# EasyEDA Pro project ProProject_Access Control AC Power Switch_2024-05-28.epro

# Schematic V2.0.1 Power Relay Schematic
Create Date: 2024-05-01; Page Name: P1; Project Name: Access Control V2; Schematic Name: V2.0.1 Power Relay Schematic; Update Date: 2024-05-10; Company: EasyEDA.com; Drawn: EasyEDA; Page Size: A4; Part Number: JLCPCB-002; Reviewed: EasyEDA; Version: V0.1
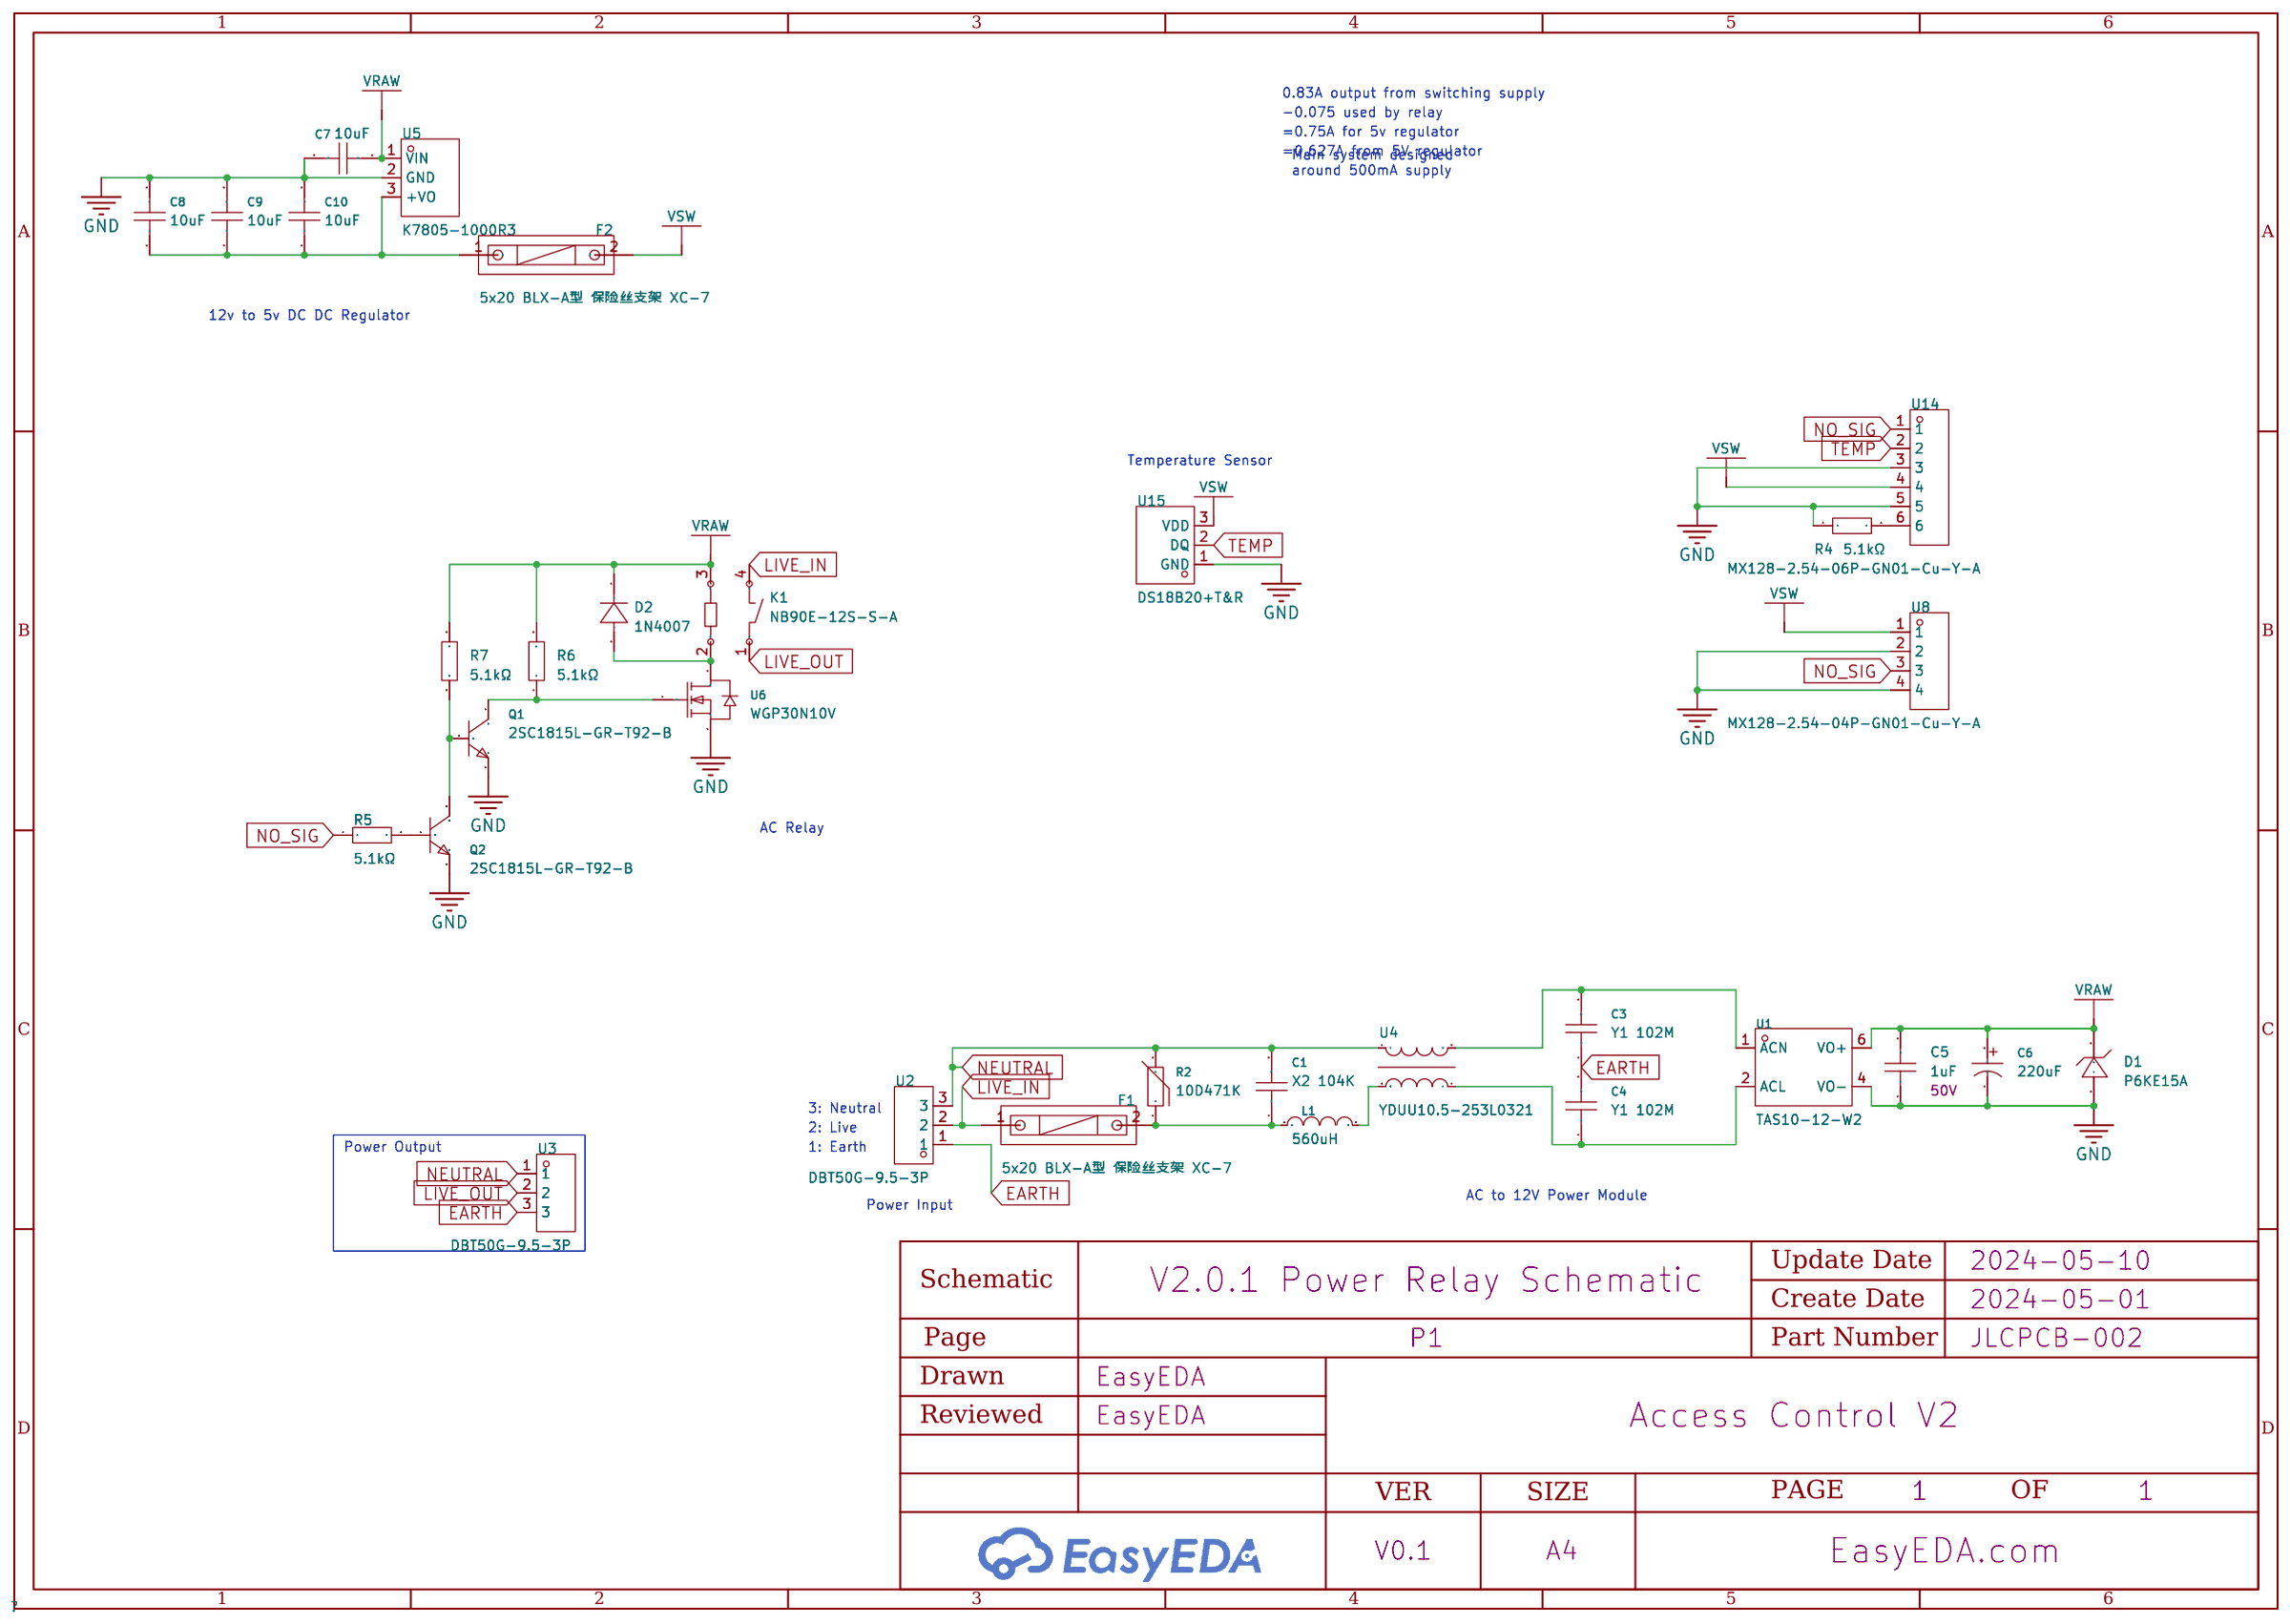
[diagram p0: schematic sheet]

## Parts
C1  100nF  [CAP-TH_L10.0-W5.0-P7.50-D0.6]
C3  1nF  [CAP-TH_L8.5-W5.0-P10.00-D0.6]
C4  1nF  [CAP-TH_L8.5-W5.0-P10.00-D0.6]
C5  1uF  [CAP-TH_L5.5-W3.5-P5.00-D1.2]
C6  220uF  [CAP-TH_BD6.3-P2.50-D1.0-FD]
C7  10uF  [CAP-TH_L5.5-W3.8-P3.50-D0.6]
C8  10uF  [CAP-TH_L5.5-W3.8-P3.50-D0.6]
C9  10uF  [CAP-TH_L5.5-W3.8-P3.50-D0.6]
C10  10uF  [CAP-TH_L5.5-W3.8-P3.50-D0.6]
D1  P6KE15A  [DO-15_BD3.2-L6.4-P10.40-D0.8-RD]
D2  1N4007  [DO-41_BD2.4-L4.7-P8.70-D0.8-RD]
F1  5x20 BLX-A型 保险丝支架 XC-7  [FUSE-TH_L22.6-W9.0]
F2  5x20 BLX-A型 保险丝支架 XC-7  [FUSE-TH_L22.6-W9.0]
K1  NB90E-12S-S-A  [RELAY-TH_NB90E-XXS-S-A]
L1  560uH  [IND-TH_BD9.0-P5.00-D0.7]
Q1  2SC1815L-GR-T92-B  [TO-92-3_L4.9-W3.7-P2.54-L]
Q2  2SC1815L-GR-T92-B  [TO-92-3_L4.9-W3.7-P2.54-L]
R2  10D471K  [RES-TH_L12.5-W6.7-P7.50-D1.2]
R4  5.1kΩ  [RES-TH_BD2.3-L6.5-P10.50-D0.5]
R5  5.1kΩ  [RES-TH_BD2.3-L6.5-P10.50-D0.5]
R6  5.1kΩ  [RES-TH_BD2.3-L6.5-P10.50-D0.5]
R7  5.1kΩ  [RES-TH_BD2.3-L6.5-P10.50-D0.5]
U1  TAS10-12-W2  [PWRM-TH_TAS10-XX-W2]
U2  DBT50G-9.5-3P  [CONN-TH_3P-P9.50_DBT50G-9.5-3P]
U3  DBT50G-9.5-3P  [CONN-TH_3P-P9.50_DBT50G-9.5-3P]
U4  YDUU10.5-253L0321  [IND-TH_4P-L19.0-W17.0]
U5  K7805-1000R3  [PWRM-TH_YLPTEC_K78XX-1000R3]
U6  WGP30N10V  [TO-220-3_L10.0-W4.6-P2.54-L]
U8  MX128-2.54-04P-GN01-Cu-Y-A  [CONN-TH_4P-P2.54_MX128-2.54-GN01-04P-CU-Y-A]
U14  MX128-2.54-06P-GN01-Cu-Y-A  [CONN-TH_6P-P2.54_MX128-2.54-6P]
U15  DS18B20+T&R  [TO-92-3_L4.9-W3.7-P2.54-L]

## Library data of the parts
C1 = PX104K2C0702: Capacitance: Tolerance:±10% Tolerance:±10% Voltage(AC):310V；380V；350V Subclass: Operating Temperature:-40℃~+110℃ Operating Temperature:-40℃~+110℃; LCSC Part Name: 等级:X2 100nF ±10% 310V 350V 380V; Supplier Part: C2693793; Manufacturer: KYET(科雅); Supplier Footprint: 插件,P=7.5mm; JLCPCB Part Class: Extended Part; Datasheet: https://atta.szlcsc.com/upload/public/pdf/source/20230824/212A883DA7F3524E26A294E17BC5A0F4.pdf; Supplier: LCSC; Tolerance: ±10%; Voltage(AC): 310V；380V；350V; Operating Temperature: -40℃~+110℃
C3 C4 = VY1102M31Y5UC63V0: Capacitance: Tolerance:±20% Tolerance:±20% Voltage(AC):760V Subclass: Operating Temperature:-40℃~+125℃ Operating Temperature:-40℃~+125℃; LCSC Part Name: 等级:X1,Y1 1nF ±20% 760V; Supplier Part: C1620957; Manufacturer: VISHAY(威世); Supplier Footprint: 插件,P=10mm; JLCPCB Part Class: Extended Part; Datasheet: https://atta.szlcsc.com/upload/public/pdf/source/20210503/4C6D9DFEC0766624DBEA7F26F929BB18.pdf; Supplier: LCSC; Tolerance: ±20%; Voltage(AC): 760V; Operating Temperature: -40℃~+125℃
C5 = FK26X7R1H105KRE06: Capacitance: Tolerance:±10% Tolerance:±10% Voltage Rated: Lead Spacing: Temperature Coefficient:; LCSC Part Name: 1uF ±10% 50V; Supplier Part: C2839237; Manufacturer: TDK; Supplier Footprint: 插件,P=5mm; JLCPCB Part Class: Extended Part; Datasheet: https://atta.szlcsc.com/upload/public/pdf/source/20211011/CA0C243CD946D294CDFF83D03DB16AD9.pdf; Supplier: LCSC; Tolerance: ±10%; Voltage Rated: 50V
C6 = KM227M025E11RR0VH2FP0: Capacitance:220uF Tolerance:±20% Tolerance:±20% Rated Voltage: Ripple Current:- Equivalent Series Resistance(ESR):- Lead Spacing: φD: L: Lifetime @ Temp:1000hrs@105℃; LCSC Part Name: 220uF ±20% 25V; Supplier Part: C12450; Manufacturer: CX(承兴); Supplier Footprint: 插件,D6.3xL11mm; JLCPCB Part Class: Extended Part; Datasheet: https://atta.szlcsc.com/upload/public/pdf/source/20211027/06D6BA3719C264B639DC286D935D03EA.pdf; Supplier: LCSC; Tolerance: ±20%; Lifetime @ Temp: 1000hrs@105℃
C7-C10 = CD1E106MC9BER2F100: Capacitance:10uF Tolerance:±20% Tolerance:±20% Voltage Rated: Temperature Coefficient:; LCSC Part Name: 10uF ±20% 25V; Supplier Part: C2761733; Manufacturer: Dersonic(德尔创); Supplier Footprint: 插件,P=5.08mm; JLCPCB Part Class: Extended Part; Datasheet: https://atta.szlcsc.com/upload/public/pdf/source/20210512/C2761733_48A4F8FFA54EF14BEC181E01EC41507A.pdf; Supplier: LCSC; Tolerance: ±20%
D1 = P6KE15A_C1974865: polarity:Unidirectional Reverse Stand-Off Voltage (Vrwm):12.8V Maximum Clamping Voltage:21.2V Peak Pulse Current (Ipp)@10/1000us:28.8A Peak Pulse Power Dissipation (Ppp)@10/1000us:600W Breakdown Voltage:14.3V Type:TVS; LCSC Part Name: TVS 12.8V截止 28.8A峰值脉冲; Supplier Part: C1974865; Manufacturer: Littelfuse(美国力特); Supplier Footprint: DO-15(DO-204AC); JLCPCB Part Class: Extended Part; Datasheet: https://atta.szlcsc.com/upload/public/pdf/source/20210316/C2760121_CE745CC1535F4E7F6CA9D58EF9C8652B.pdf; Supplier: LCSC; polarity: Unidirectional; Reverse Stand-Off Voltage (Vrwm): 12.8V; Maximum Clamping Voltage: 21.2V; Peak Pulse Current (Ipp)@10/1000us: 28.8A; Peak Pulse Power Dissipation (Ppp)@10/1000us: 600W; Breakdown Voltage: 14.3V; Type: TVS
D2 = 1N4007_C2985028: Forward Voltage (Vf@If):1V@1A Reverse Voltage (Vr): Average Rectified Current (Io):; LCSC Part Name: 电压:1kV 电流:1A; Supplier Part: C2985028; Manufacturer: GOODWORK(固得沃克); Supplier Footprint: DO-41; JLCPCB Part Class: Extended Part; Datasheet: https://atta.szlcsc.com/upload/public/pdf/source/20210723/C2848669_ECFE0BC1B34B7BAAA686846FF0F306A7.pdf; Supplier: LCSC; Forward Voltage (Vf@If): 1V@1A
F1 F2 = 5x20 BLX-A型 保险丝支架 XC-7: Fuseholder Type:- Fuse Type:- Fuse Size:-; LCSC Part Name: 保险丝座 5x20 BLX-A型; Supplier Part: C3131; Manufacturer: xcfuse(旭程); JLCPCB Part Class: Extended Part; Datasheet: https://atta.szlcsc.com/upload/public/pdf/source/20160427/1461725215151.pdf; Supplier: LCSC
K1 = NB90E-12S-S-A: Coil Voltage:12V Contact Form:一组常开:1A(SPST-常开) Pin Number:- Contact Rating:- Maximum Switching Voltage:277V@AC；30V@DC Coil Rated Power:900mW Contact Material:AgSnO2 Maximum Switching Current:30A Coil Type:无极性-单线圈 Coil Resistance:160Ω Contact Resistance:10; LCSC Part Name: 12V继电器 单刀单掷-常开; Supplier Part: C396894; Manufacturer: NBC(宝橙); Supplier Footprint: 插件,27.2x32mm; JLCPCB Part Class: Extended Part; Datasheet: https://atta.szlcsc.com/upload/public/pdf/source/20190621/C396896_7BA89285BD2A8229CEB67C9FBB667B77.pdf; Supplier: LCSC; Coil Voltage: 12V; Contact Form: 一组常开:1A(SPST-常开); Maximum Switching Voltage: 277V@AC；30V@DC; Coil Rated Power: 900mW; Contact Material: AgSnO2; Maximum Switching Current: 30A; Coil Type: 无极性-单线圈; Coil Resistance: 160Ω; Contact Resistance: 100mΩ; Operate Time: 15ms; Release Time: 10ms; Operating Temperature: -55℃~+85℃
L1 = PK0810-561KB: Inductance: Tolerance:±10% Tolerance:±10% Rated Current: DC Resistance (DCR): Type:工字电感; LCSC Part Name: 560uH ±10%; Supplier Part: C122800; Manufacturer: SXN(顺翔诺); Supplier Footprint: 插件; JLCPCB Part Class: Extended Part; Datasheet: https://atta.szlcsc.com/upload/public/pdf/source/20210810/BA6D1DA7D4BCBB7C641BC97B42CFC6FF.pdf; Supplier: LCSC; Tolerance: ±10%; Type: 工字电感
Q1 Q2 = 2SC1815L-GR-T92-B: Transistor Type: Collector Current (Ic): Collector-Emitter Breakdown Voltage (Vceo): Power Dissipation (Pd):; LCSC Part Name: 耐压:50V 电流:150mA NPN hfe=200~400; Supplier Part: C73309; Manufacturer: UTC(友顺); Supplier Footprint: TO-92-2.54mm; JLCPCB Part Class: Extended Part; Datasheet: https://atta.szlcsc.com/upload/public/pdf/source/20170209/1486607344255.pdf; Supplier: LCSC
R2 = 10D471K_C8760: Varistor Voltage:423V~517V Varistor Voltage:423V~517V Clamping Voltage: Allowable Voltage (DC): Allowable Voltage (AC): Peak Current: Maximum Energy:42.3J Maximum Energy:42.3J Typical Capatitance:190pF@1kHz; LCSC Part Name: 钳位电压775V 42.3焦耳 插件压敏电阻; Supplier Part: C8760; Manufacturer: RUILON(瑞隆源); Supplier Footprint: 插件; JLCPCB Part Class: Extended Part; Datasheet: https://atta.szlcsc.com/upload/public/pdf/source/20160725/1469440740918.pdf; Supplier: LCSC; Varistor Voltage: 423V~517V; Maximum Energy: 42.3J; Typical Capatitance: 190pF@1kHz
R4-R7 = CF1/4W-5.1KΩ±5% T: Type:Carbon Resister Resistance: Tolerance:±5% Tolerance:±5% Overload Voltage (Max):250V Power(Watts):250mW Temperature Coefficient:±350ppm/℃ Temperature Coefficient:±350ppm/℃ Operating Temperature Range:-55℃~+155℃ Operating Temperature Range:-55℃~+155℃; LCSC Part Name: 5.1kΩ ±5% 250mW 碳膜电阻; Supplier Part: C120072; Manufacturer: CCO(千志电子); Supplier Footprint: 插件,D2.3xL6.5mm; JLCPCB Part Class: Extended Part; Datasheet: https://atta.szlcsc.com/upload/public/pdf/source/20190910/C427328_A0A2D65F3FD547937F4E674C90868175.pdf; Supplier: LCSC; Type: Carbon Resister; Tolerance: ±5%; Overload Voltage (Max): 250V; Power(Watts): 250mW; Temperature Coefficient: ±350ppm/℃; Operating Temperature Range: -55℃~+155℃
U1 = TAS10-12-W2: Conversion Type:AC-DC；AC/DC-DC Input Voltage(DC):100V~370V Input Voltage(DC):100V~370V Output Voltage:12V Output Voltage:12V Output Power:10W Input Voltage(AC):85VAC~265VAC Input Voltage(AC):85VAC~265VAC Output Current (Max):830mA Output Current (Max):830; Supplier Part: C2687656; Manufacturer: TDPOWER(腾达电源); Supplier Footprint: 插件,25x39mm; JLCPCB Part Class: Extended Part; Datasheet: https://atta.szlcsc.com/upload/public/pdf/source/20210914/95F169B7B21081D929A6CFE8A15609A6.pdf; Supplier: LCSC; Conversion Type: AC-DC；AC/DC-DC; Input Voltage(DC): 100V~370V; Output Voltage: 12V; Output Power: 10W; Input Voltage(AC): 85VAC~265VAC; Output Current (Max): 830mA; Function: 降压型; Isolation or not: 隔离; Output Channel: 1; Insulated Voltage: 2.5kV@AC; Conversion Efficiency: 85%; Feature: Overcurrent Protection；短路保护自恢复
U2 U3 = DBT50G-9.5-3P: Barrier Type:带盖板 Pitch:9.5mm Structure:1x3P Mounting Style:直针 Pin Location:边脚 Number of Pins:3P Number of Rows:1 Current Rating (Max):32A Voltage Rating (Max):750V Wire Gauge - AWG:12~22 Wire Gauge - mm2:4 Operating Temperature Range:-40℃~+105℃ Operating; LCSC Part Name: 9.5mm 1x3P 每排P数:3 排数:1 直针 边脚; Supplier Part: C395959; Manufacturer: DORABO(地博电气); Supplier Footprint: 插件,P=9.5mm; JLCPCB Part Class: Extended Part; Datasheet: https://atta.szlcsc.com/upload/public/pdf/source/20221019/84C53DE9D8912EDE417B2211EE296996.pdf; Supplier: LCSC; Barrier Type: 带盖板; Pitch: 9.5mm; Structure: 1x3P; Mounting Style: 直针; Pin Location: 边脚; Number of Pins: 3P; Number of Rows: 1; Current Rating (Max): 32A; Voltage Rating (Max): 750V; Wire Gauge - AWG: 12~22; Wire Gauge - mm2: 4; Operating Temperature Range: -40℃~+105℃; Color: Black; Number of PINs Per Row: 3
U4 = YDUU10.5-253L0321: Number of Lines:2 Withstanding Voltage:1.5kV@AC Inductance @ Frequency:25mH@1KHz; LCSC Part Name: UU10.5 25mH @1KHz; Supplier Part: C5200263; Manufacturer: YJYCOIN(益嘉源); Supplier Footprint: 插件,19x17x22mm; JLCPCB Part Class: Extended Part; Datasheet: https://atta.szlcsc.com/upload/public/pdf/source/20221019/CF3EF2D4E89C9F1A1EF6A77931981DBC.pdf; Supplier: LCSC; Number of Lines: 2; Withstanding Voltage: 1.5kV@AC; Inductance @ Frequency: 25mH@1KHz
U5 = K7805-1000R3: Conversion Type:DC-DC Input Voltage(DC):8V~36V Input Voltage(DC):8V~36V Output Voltage:5V Output Voltage:5V Output Power:5W Output Current (Max):1A Output Current (Max):1A Function:升降压型 Isolation or not:非隔离 Output Channel:1 Insulated Voltage:- Conversion; LCSC Part Name: DC-DC 输入电压8V~36V 输出电压5V输出功率5W1000mA; Supplier Part: C2992391; Manufacturer: YLPTEC(易川); Supplier Footprint: 插件; JLCPCB Part Class: Extended Part; Datasheet: https://atta.szlcsc.com/upload/public/pdf/source/20220510/13042FEFCE8A01FC3BA968F60B4D6D28.pdf; Supplier: LCSC; Conversion Type: DC-DC; Input Voltage(DC): 8V~36V; Output Voltage: 5V; Output Power: 5W; Output Current (Max): 1A; Function: 升降压型; Isolation or not: 非隔离; Output Channel: 1; Conversion Efficiency: 93%; Feature: Short-Circuit Protection；Low-Power Consumption; Maximum Capacitive Load: 680uF
U6 = WGP30N10V: Type:1个NChannel Drain Source Voltage (Vdss): Continuous Drain Current (Id): Power Dissipation (Pd): Drain Source On Resistance (RDS(on)@Vgs,Id):36mΩ@10V,; LCSC Part Name: 1个N沟道 耐压:100V 电流:30A; Supplier Part: C17702381; Manufacturer: Wild Goose(威谷); Supplier Footprint: TO-220; Datasheet: https://atta.szlcsc.com/upload/public/pdf/source/20230915/178B7459ABA4E98915C1CC177AA9479D.pdf; Supplier: LCSC; Type: 1个NChannel; Drain Source On Resistance (RDS(on)@Vgs,Id): 36mΩ@10V,
U8 = MX128-2.54-04P-GN01-Cu-Y-A: Structure:1x4P Pitch:2.54mm Color:Green Mounting Style:Straight Current Rating (Max):6A Voltage Rating (Max):150V Number of Pins:4P Number of Rows:1 Wire Gauge - AWG:18~24 Wire Gauge - AWG:18~24 Wire Gauge - mm2:1 Wire Gauge - mm2:1 Number of PINs Per Row; LCSC Part Name: 2.54mm 1x4P 排数:1 每排P数:4 直插; Supplier Part: C5188444; Manufacturer: MAX(迈旭); Supplier Footprint: 插件,P=2.54mm; JLCPCB Part Class: Extended Part; Datasheet: https://atta.szlcsc.com/upload/public/pdf/source/20230914/7C75AD31AD41EB9EF855A76DB002C0D2.pdf; Supplier: LCSC; Structure: 1x4P; Pitch: 2.54mm; Color: Green; Mounting Style: Straight; Current Rating (Max): 6A; Voltage Rating (Max): 150V; Number of Pins: 4P; Number of Rows: 1; Wire Gauge - AWG: 18~24; Wire Gauge - mm2: 1; Number of PINs Per Row: 4; Contact Material: Copper Alloy; Contact Plating: Tin; Operating Temperature Range: -40℃~+105℃
U14 = MX128-2.54-06P-GN01-Cu-Y-A: Structure:1x6P Pitch:2.54mm Color:Green Mounting Style:Straight Current Rating (Max):6A Voltage Rating (Max):150V Number of Pins:6P Number of Rows:1 Wire Gauge - AWG:18~24 Wire Gauge - AWG:18~24 Wire Gauge - mm2:1 Wire Gauge - mm2:1 Number of PINs Per Row; LCSC Part Name: 2.54mm 1x6P 排数:1 每排P数:6 直插; Supplier Part: C5188446; Manufacturer: MAX(迈旭); Supplier Footprint: 插件,P=2.54mm; JLCPCB Part Class: Extended Part; Datasheet: https://atta.szlcsc.com/upload/public/pdf/source/20230914/7C75AD31AD41EB9EF855A76DB002C0D2.pdf; Supplier: LCSC; Structure: 1x6P; Pitch: 2.54mm; Color: Green; Mounting Style: Straight; Current Rating (Max): 6A; Voltage Rating (Max): 150V; Number of Pins: 6P; Number of Rows: 1; Wire Gauge - AWG: 18~24; Wire Gauge - mm2: 1; Number of PINs Per Row: 6; Contact Material: Copper Alloy; Contact Plating: Tin; Operating Temperature Range: -40℃~+105℃
U15 = DS18B20+T&R: Supply Voltage:3V~5.5V Supply Voltage:3V~5.5V; Supplier Part: C880672; Manufacturer: ADI(亚德诺)/MAXIM(美信); Supplier Footprint: TO-92; JLCPCB Part Class: Extended Part; Datasheet: https://atta.szlcsc.com/upload/public/pdf/source/20201223/C880672_EEBB787AABBE3FE11FE7BE07B2E2EC5E.pdf; Supplier: LCSC; Supply Voltage: 3V~5.5V

## Nets
GND: C5.1 C6.2 C7.2 C8.2 C9.2 C10.2 D1.2(A) Q1.1(E) Q2.1(E) R4.1 U1.4(VO-) U5.2(GND) U6.3(S) U8.2 U8.4 U14.3 U14.5 U15.1(GND)
EARTH: C3.1 C4.2 U2.1 U3.3
LIVE_IN: F1.1 K1.4 U2.2
LIVE_OUT: K1.1 U3.2
NEUTRAL: C1.2 R2.2 U2.3 U3.1 U4.4
NO_SIG: R5.1 U8.3 U14.1
TEMP: U14.2 U15.2(DQ)
VRAW: C5.2 C6.1 C7.1 D1.1(C) D2.1(K) K1.3 R6.2 R7.2 U1.6(VO+) U5.1(VIN)
VSW: F2.2 U8.1 U14.4 U15.3(VDD)
$1N1267: C1.1 F1.2 L1.1 R2.1
$1N2210: C8.1 C9.1 C10.1 F2.1 U5.3(+VO)
$1N2775: D2.2(A) K1.2 U6.2(D)
$1N2784: Q1.2(C) R6.1 U6.1(G)
$1N3014: Q1.3(B) Q2.2(C) R7.1
$1N3022: Q2.3(B) R5.2
$1N3091: L1.2 U4.3
$1N3100: C3.2 U1.1(ACN) U4.2
$1N3107: C4.1 U1.2(ACL) U4.1
$1N5095: R4.2 U14.6

## Notes on the sheet
- 0.83A output from switching supply
- -0.075 used by relay
- =0.627A from 5V regulator
- =0.75A for 5v regulator
- Main system designed
  around 500mA supply
- 12v to 5v DC DC Regulator
- Temperature Sensor
- AC Relay
- 3: Neutral
- 2: Live
- Power Output
- 1: Earth
- Power Input
- AC to 12V Power Module

# Schematic V2.0.1B Schematic
Create Date: 2024-05-14; Page Name: Main Page; Project Name: Access Control V2.1; Schematic Name: V2.0.1B Power Relay Schematic; Update Date: 2024-05-22; Company: RIT SHED MAKERSPACE; Drawn: Jim Heaney; Page Size: A4; Part Number: N/A; Reviewed: Jim Heaney; Version: V2.1.0
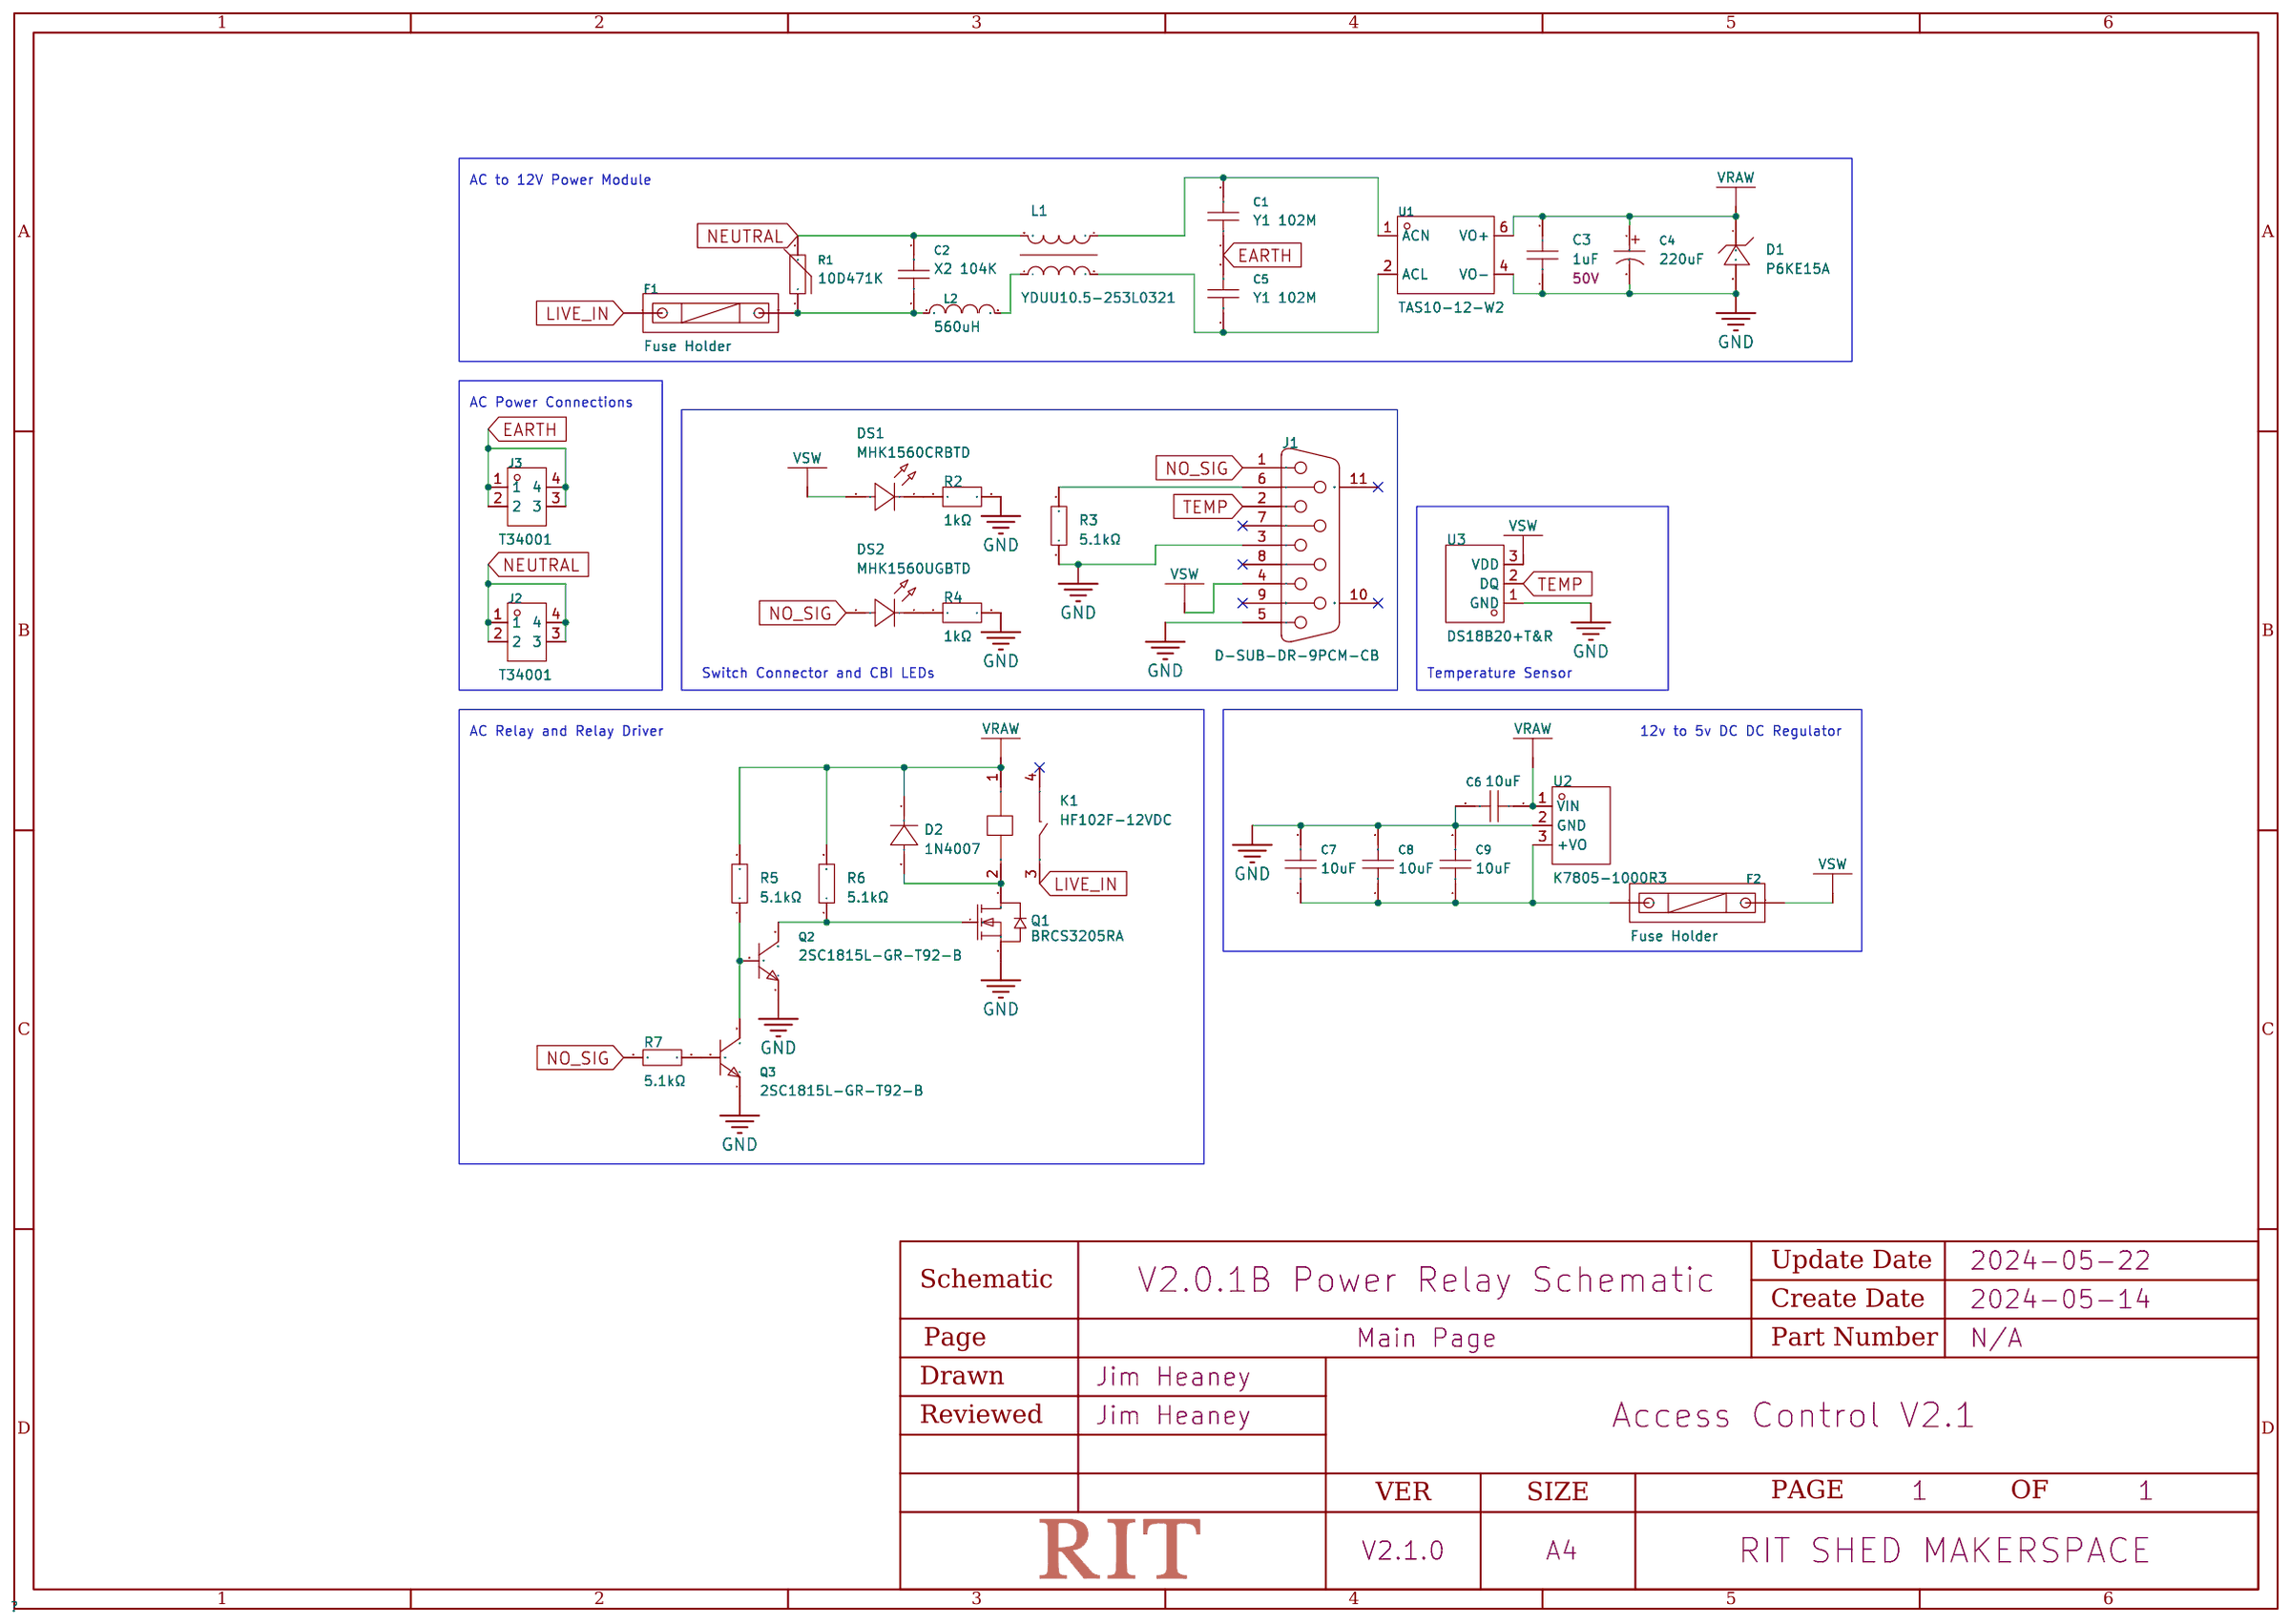
[diagram p1: schematic sheet]

## Parts
C1  1nF  [CAP-TH_L8.5-W5.0-P10.00-D0.6]
C2  100nF  [CAP-TH_L10.0-W5.0-P7.50-D0.6]
C3  1uF  [CAP-TH_L5.5-W3.5-P5.00-D1.2]
C4  220uF  [CAP-TH_BD6.3-P2.50-D1.0-FD]
C5  1nF  [CAP-TH_L8.5-W5.0-P10.00-D0.6]
C6  10uF  [CAP-TH_L5.5-W3.8-P3.50-D0.6]
C7  10uF  [CAP-TH_L5.5-W3.8-P3.50-D0.6]
C8  10uF  [CAP-TH_L5.5-W3.8-P3.50-D0.6]
C9  10uF  [CAP-TH_L5.5-W3.8-P3.50-D0.6]
D1  P6KE15A  [DO-15_BD3.2-L6.4-P10.40-D0.8-RD]
D2  1N4007  [DO-41_BD2.4-L4.7-P8.70-D0.8-RD]
DS1  MHK1560CRBTD  [LED-TH_MHK1560UGBTD]
DS2  MHK1560UGBTD  [LED-TH_MHK1560UGBTD]
F1  Fuse Holder  [FUSE-TH_L24.5-W9.8-P22.5]
F2  Fuse Holder  [FUSE-TH_L24.5-W9.8-P22.5]
J1  D-SUB-DR-9PCM-CB  [DB9-TH_ID09S33E4GV00LF]
J2  T34001  [CONN-TH_T34001]
J3  T34001  [CONN-TH_T34001]
K1  HF102F-12VDC  [RELAY-TH_HF102F-12VDC]
L1  YDUU10.5-253L0321  [IND-TH_4P-L19.0-W17.0]
L2  560uH  [IND-TH_BD9.0-P5.00-D0.7]
Q1  BRCS3205RA  [TO-220-3_L10.0-W4.5-P2.54-L]
Q2  2SC1815L-GR-T92-B  [TO-92-3_L4.9-W3.7-P2.54-L]
Q3  2SC1815L-GR-T92-B  [TO-92-3_L4.9-W3.7-P2.54-L]
R1  10D471K  [RES-TH_L12.5-W6.7-P7.50-D1.2]
R2  1kΩ  [RES-TH_BD2.3-L6.5-P10.50-D0.5]
R3  5.1kΩ  [RES-TH_BD2.3-L6.5-P10.50-D0.5]
R4  1kΩ  [RES-TH_BD2.3-L6.5-P10.50-D0.5]
R5  5.1kΩ  [RES-TH_BD2.3-L6.5-P10.50-D0.5]
R6  5.1kΩ  [RES-TH_BD2.3-L6.5-P10.50-D0.5]
R7  5.1kΩ  [RES-TH_BD2.3-L6.5-P10.50-D0.5]
U1  TAS10-12-W2  [PWRM-TH_TAS10-XX-W2]
U2  K7805-1000R3  [PWRM-TH_YLPTEC_K78XX-1000R3]
U3  DS18B20+T&R  [TO-92-3_L4.9-W3.7-P2.54-L]

## Library data of the parts
C1 C5 = VY1102M31Y5UC63V0: Capacitance: Tolerance:±20% Tolerance:±20% Voltage(AC):760V Subclass: Operating Temperature:-40℃~+125℃ Operating Temperature:-40℃~+125℃; LCSC Part Name: 等级:X1,Y1 1nF ±20% 760V; Supplier Part: C1620957; Manufacturer: VISHAY(威世); Supplier Footprint: 插件,P=10mm; JLCPCB Part Class: Extended Part; Datasheet: https://atta.szlcsc.com/upload/public/pdf/source/20210503/4C6D9DFEC0766624DBEA7F26F929BB18.pdf; Supplier: LCSC; Tolerance: ±20%; Voltage(AC): 760V; Operating Temperature: -40℃~+125℃
C2 = PX104K2C0702: Capacitance: Tolerance:±10% Tolerance:±10% Voltage(AC):310V；380V；350V Subclass: Operating Temperature:-40℃~+110℃ Operating Temperature:-40℃~+110℃; LCSC Part Name: 等级:X2 100nF ±10% 310V 350V 380V; Supplier Part: C2693793; Manufacturer: KYET(科雅); Supplier Footprint: 插件,P=7.5mm; JLCPCB Part Class: Extended Part; Datasheet: https://atta.szlcsc.com/upload/public/pdf/source/20230824/212A883DA7F3524E26A294E17BC5A0F4.pdf; Supplier: LCSC; Tolerance: ±10%; Voltage(AC): 310V；380V；350V; Operating Temperature: -40℃~+110℃
C3 = FK26X7R1H105KRE06: Capacitance: Tolerance:±10% Tolerance:±10% Voltage Rated: Lead Spacing: Temperature Coefficient:; LCSC Part Name: 1uF ±10% 50V; Supplier Part: C2839237; Manufacturer: TDK; Supplier Footprint: 插件,P=5mm; JLCPCB Part Class: Extended Part; Datasheet: https://atta.szlcsc.com/upload/public/pdf/source/20211011/CA0C243CD946D294CDFF83D03DB16AD9.pdf; Supplier: LCSC; Tolerance: ±10%; Voltage Rated: 50V
C4 = KM227M025E11RR0VH2FP0: Capacitance:220uF Tolerance:±20% Tolerance:±20% Rated Voltage: Ripple Current:- Equivalent Series Resistance(ESR):- Lead Spacing: φD: L: Lifetime @ Temp:1000hrs@105℃; LCSC Part Name: 220uF ±20% 25V; Supplier Part: C12450; Manufacturer: CX(承兴); Supplier Footprint: 插件,D6.3xL11mm; JLCPCB Part Class: Extended Part; Datasheet: https://atta.szlcsc.com/upload/public/pdf/source/20211027/06D6BA3719C264B639DC286D935D03EA.pdf; Supplier: LCSC; Tolerance: ±20%; Lifetime @ Temp: 1000hrs@105℃
C6-C9 = CD1E106MC9BER2F100: Capacitance:10uF Tolerance:±20% Tolerance:±20% Voltage Rated: Temperature Coefficient:; LCSC Part Name: 10uF ±20% 25V; Supplier Part: C2761733; Manufacturer: Dersonic(德尔创); Supplier Footprint: 插件,P=5.08mm; JLCPCB Part Class: Extended Part; Datasheet: https://atta.szlcsc.com/upload/public/pdf/source/20210512/C2761733_48A4F8FFA54EF14BEC181E01EC41507A.pdf; Supplier: LCSC; Tolerance: ±20%
D1 = P6KE15A_C1974865: polarity:Unidirectional Reverse Stand-Off Voltage (Vrwm):12.8V Maximum Clamping Voltage:21.2V Peak Pulse Current (Ipp)@10/1000us:28.8A Peak Pulse Power Dissipation (Ppp)@10/1000us:600W Breakdown Voltage:14.3V Type:TVS; LCSC Part Name: TVS 12.8V截止 28.8A峰值脉冲; Supplier Part: C1974865; Manufacturer: Littelfuse(美国力特); Supplier Footprint: DO-15(DO-204AC); JLCPCB Part Class: Extended Part; Datasheet: https://atta.szlcsc.com/upload/public/pdf/source/20210316/C2760121_CE745CC1535F4E7F6CA9D58EF9C8652B.pdf; Supplier: LCSC; polarity: Unidirectional; Reverse Stand-Off Voltage (Vrwm): 12.8V; Maximum Clamping Voltage: 21.2V; Peak Pulse Current (Ipp)@10/1000us: 28.8A; Peak Pulse Power Dissipation (Ppp)@10/1000us: 600W; Breakdown Voltage: 14.3V; Type: TVS
D2 = 1N4007_C2985028: Forward Voltage (Vf@If):1V@1A Reverse Voltage (Vr): Average Rectified Current (Io):; LCSC Part Name: 电压:1kV 电流:1A; Supplier Part: C2985028; Manufacturer: GOODWORK(固得沃克); Supplier Footprint: DO-41; JLCPCB Part Class: Extended Part; Datasheet: https://atta.szlcsc.com/upload/public/pdf/source/20210723/C2848669_ECFE0BC1B34B7BAAA686846FF0F306A7.pdf; Supplier: LCSC; Forward Voltage (Vf@If): 1V@1A
DS1 = MHK1560CGBTD: 20mA 雾状红透镜 50mcd -40℃~+85℃ 632nm Red 85° 1.75V~2.2V Plugin,P=2.54mm Light Emitting Diodes (LED) ROHS; LCSC Part Name: 1560直插单灯翠绿色光; Supplier Part: C7470835; Manufacturer: MEIHUA(美华); Supplier Footprint: 插件,P=2.54mm; JLCPCB Part Class: Extended Part; Datasheet: https://atta.szlcsc.com/upload/public/pdf/source/20231114/0151DB1F997DCF286213A722D08B4BAA.pdf; Supplier: LCSC; Emitted Color: Emerald; Forward Voltage (VF): 1.75V~2.2V; Forward Current: 20mA; Dominant Wavelength: 520nm; Lens Color: 雾状绿透镜; Luminous Intensity: 1000mcd; Viewing Angle: 85°; Operating Temperature: -40℃~+85℃
DS2 = MHK1560UGBTD: Emitted Color:Emerald Forward Voltage (VF):1.75V~2.2V Forward Voltage (VF):1.75V~2.2V Forward Current:20mA Dominant Wavelength:520nm Dominant Wavelength:520nm Lens Color:雾状绿透镜 Luminous Intensity:1000mcd Luminous Intensity:1000mcd Viewing Angle:85° Operati; LCSC Part Name: 1560直插单灯翠绿色光; Supplier Part: C7470833; Manufacturer: MEIHUA(美华); Supplier Footprint: 插件,P=2.54mm; JLCPCB Part Class: Extended Part; Datasheet: https://atta.szlcsc.com/upload/public/pdf/source/20231114/0151DB1F997DCF286213A722D08B4BAA.pdf; Supplier: LCSC; Emitted Color: Emerald; Forward Voltage (VF): 1.75V~2.2V; Forward Current: 20mA; Dominant Wavelength: 520nm; Lens Color: 雾状绿透镜; Luminous Intensity: 1000mcd; Viewing Angle: 85°; Operating Temperature: -40℃~+85℃
F1 F2 = 保险丝透明座: Fuseholder Type:- Fuse Type:- Fuse Size:-; LCSC Part Name: 保险丝座 5*20 透明座(两件套); Supplier Part: C58066; Manufacturer: xcfuse(旭程); JLCPCB Part Class: Extended Part; Datasheet: https://atta.szlcsc.com/upload/public/pdf/source/20201109/C58066_EF84FEEE40948BE1BD26BCA72E4FE443.pdf; Supplier: LCSC
J1 = D-SUB-DR-9PCM-CB: Connector Type:D-Sub Gender:Female Number of Pins:9P Mounting Style:Right-Angle Number of Rows:2 Current Rating (Max):3A Contact Plating:Tin Operating Temperature Range:-50℃~+105℃ Operating Temperature Range:-50℃~+105℃; LCSC Part Name: D-Sub 母 P数:9P; Supplier Part: C19077337; Manufacturer: XUNPU(讯普); Supplier Footprint: 弯插; JLCPCB Part Class: Extended Part; Datasheet: https://atta.szlcsc.com/upload/public/pdf/source/20231108/FB2E8AB0BE4F620DDF3F7F4D0B9AFB97.pdf; Supplier: LCSC; Connector Type: D-Sub; Gender: Female; Number of Pins: 9P; Mounting Style: Right-Angle; Number of Rows: 2; Current Rating (Max): 3A; Contact Plating: Tin; Operating Temperature Range: -50℃~+105℃
J2 J3 = T34001: LCSC Part Name: 四脚 M3 二件套; Supplier Part: C481448; Manufacturer: XFCN(兴飞); Supplier Footprint: 插件; JLCPCB Part Class: Extended Part; Datasheet: https://atta.szlcsc.com/upload/public/pdf/source/20200107/C481448_4214B4EB74A46B70BD82BA8A456D4EDD.pdf; Supplier: LCSC
K1 = HF102F-12VDC: Coil Voltage:12V Contact Form:一组常开:1A(SPST-常开) Pin Number:4 Contact Rating:20A@250VAC Maximum Switching Voltage:250V@AC Coil Rated Power:900mW Contact Material:AgCdO Maximum Switching Current:25A Coil Type:无极性-单线圈 Coil Resistance:640Ω Contact Resistance:1; LCSC Part Name: 小型大功率12V继电器 单刀单掷-常开 适用于电机负载; Supplier Part: C250652; Manufacturer: HF(宏发); Supplier Footprint: 插件,16x30.5mm; JLCPCB Part Class: Extended Part; Datasheet: https://atta.szlcsc.com/upload/public/pdf/source/20180709/C250652_2CDFE87553D11B6EDA7440E1EF3F00EA.pdf; Supplier: LCSC; Coil Voltage: 12V; Contact Form: 一组常开:1A(SPST-常开); Pin Number: 4; Contact Rating: 20A@250VAC; Maximum Switching Voltage: 250V@AC; Coil Rated Power: 900mW; Contact Material: AgCdO; Maximum Switching Current: 25A; Coil Type: 无极性-单线圈; Coil Resistance: 640Ω; Contact Resistance: 100mΩ; Operate Time: 20ms; Release Time: 10ms; Operating Temperature: -25℃~+85℃
L1 = YDUU10.5-253L0321: Number of Lines:2 Withstanding Voltage:1.5kV@AC Inductance @ Frequency:25mH@1KHz; LCSC Part Name: UU10.5 25mH @1KHz; Supplier Part: C5200263; Manufacturer: YJYCOIN(益嘉源); Supplier Footprint: 插件,19x17x22mm; JLCPCB Part Class: Extended Part; Datasheet: https://atta.szlcsc.com/upload/public/pdf/source/20221019/CF3EF2D4E89C9F1A1EF6A77931981DBC.pdf; Supplier: LCSC; Number of Lines: 2; Withstanding Voltage: 1.5kV@AC; Inductance @ Frequency: 25mH@1KHz
L2 = PK0810-561KB: Inductance: Tolerance:±10% Tolerance:±10% Rated Current: DC Resistance (DCR): Type:工字电感; LCSC Part Name: 560uH ±10%; Supplier Part: C122800; Manufacturer: SXN(顺翔诺); Supplier Footprint: 插件; JLCPCB Part Class: Extended Part; Datasheet: https://atta.szlcsc.com/upload/public/pdf/source/20210810/BA6D1DA7D4BCBB7C641BC97B42CFC6FF.pdf; Supplier: LCSC; Tolerance: ±10%; Type: 工字电感
Q1 = BRCS3205RA: Type:1个NChannel Drain Source Voltage (Vdss): Continuous Drain Current (Id): Power Dissipation (Pd): Drain Source On Resistance (RDS(on)@Vgs,Id):8mΩ@10V,90A Gate Threshold Voltage (Vgs(th)@Id):4V@250uA; LCSC Part Name: 1个N沟道 耐压:55V 电流:110A; Supplier Part: C328558; Manufacturer: BLUE ROCKET(蓝箭); Supplier Footprint: TO-220; JLCPCB Part Class: Extended Part; Datasheet: https://atta.szlcsc.com/upload/public/pdf/source/20240305/A90DF5FC3A17D55D4D137BD96C179E31.pdf; Supplier: LCSC; Type: 1个NChannel; Drain Source On Resistance (RDS(on)@Vgs,Id): 8mΩ@10V,90A; Gate Threshold Voltage (Vgs(th)@Id): 4V@250uA
Q2 Q3 = 2SC1815L-GR-T92-B: Transistor Type: Collector Current (Ic): Collector-Emitter Breakdown Voltage (Vceo): Power Dissipation (Pd):; LCSC Part Name: 耐压:50V 电流:150mA NPN hfe=200~400; Supplier Part: C73309; Manufacturer: UTC(友顺); Supplier Footprint: TO-92-2.54mm; JLCPCB Part Class: Extended Part; Datasheet: https://atta.szlcsc.com/upload/public/pdf/source/20170209/1486607344255.pdf; Supplier: LCSC
R1 = 10D471K_C8760: Varistor Voltage:423V~517V Varistor Voltage:423V~517V Clamping Voltage: Allowable Voltage (DC): Allowable Voltage (AC): Peak Current: Maximum Energy:42.3J Maximum Energy:42.3J Typical Capatitance:190pF@1kHz; LCSC Part Name: 钳位电压775V 42.3焦耳 插件压敏电阻; Supplier Part: C8760; Manufacturer: RUILON(瑞隆源); Supplier Footprint: 插件; JLCPCB Part Class: Extended Part; Datasheet: https://atta.szlcsc.com/upload/public/pdf/source/20160725/1469440740918.pdf; Supplier: LCSC; Varistor Voltage: 423V~517V; Maximum Energy: 42.3J; Typical Capatitance: 190pF@1kHz
R2 R4 = MF1/4W-1KΩ±1%T52: Type:Metal Film Resistors Resistance: Tolerance:±1% Tolerance:±1% Power(Watts):250mW Temperature Coefficient:±200ppm/℃ Temperature Coefficient:±200ppm/℃; LCSC Part Name: 金属膜电阻 1kΩ ±1% 250mW; Supplier Part: C713997; Manufacturer: 华星机电; Supplier Footprint: 插件,D2.3xL6.5mm; JLCPCB Part Class: Extended Part; Datasheet: https://atta.szlcsc.com/upload/public/pdf/source/20200731/C713882_AE8EB1102749D7E4FB4FB13DC898C429.pdf; Supplier: LCSC; Type: Metal Film Resistors; Tolerance: ±1%; Power(Watts): 250mW; Temperature Coefficient: ±200ppm/℃
R3 R5-R7 = CF1/4W-5.1KΩ±5% T: Type:Carbon Resister Resistance: Tolerance:±5% Tolerance:±5% Overload Voltage (Max):250V Power(Watts):250mW Temperature Coefficient:±350ppm/℃ Temperature Coefficient:±350ppm/℃ Operating Temperature Range:-55℃~+155℃ Operating Temperature Range:-55℃~+155℃; LCSC Part Name: 5.1kΩ ±5% 250mW 碳膜电阻; Supplier Part: C120072; Manufacturer: CCO(千志电子); Supplier Footprint: 插件,D2.3xL6.5mm; JLCPCB Part Class: Extended Part; Datasheet: https://atta.szlcsc.com/upload/public/pdf/source/20190910/C427328_A0A2D65F3FD547937F4E674C90868175.pdf; Supplier: LCSC; Type: Carbon Resister; Tolerance: ±5%; Overload Voltage (Max): 250V; Power(Watts): 250mW; Temperature Coefficient: ±350ppm/℃; Operating Temperature Range: -55℃~+155℃
U1 = TAS10-12-W2: Conversion Type:AC-DC；AC/DC-DC Input Voltage(DC):100V~370V Input Voltage(DC):100V~370V Output Voltage:12V Output Voltage:12V Output Power:10W Input Voltage(AC):85VAC~265VAC Input Voltage(AC):85VAC~265VAC Output Current (Max):830mA Output Current (Max):830; Supplier Part: C2687656; Manufacturer: TDPOWER(腾达电源); Supplier Footprint: 插件,25x39mm; JLCPCB Part Class: Extended Part; Datasheet: https://atta.szlcsc.com/upload/public/pdf/source/20210914/95F169B7B21081D929A6CFE8A15609A6.pdf; Supplier: LCSC; Conversion Type: AC-DC；AC/DC-DC; Input Voltage(DC): 100V~370V; Output Voltage: 12V; Output Power: 10W; Input Voltage(AC): 85VAC~265VAC; Output Current (Max): 830mA; Function: 降压型; Isolation or not: 隔离; Output Channel: 1; Insulated Voltage: 2.5kV@AC; Conversion Efficiency: 85%; Feature: Overcurrent Protection；短路保护自恢复
U2 = K7805-1000R3: Conversion Type:DC-DC Input Voltage(DC):8V~36V Input Voltage(DC):8V~36V Output Voltage:5V Output Voltage:5V Output Power:5W Output Current (Max):1A Output Current (Max):1A Function:升降压型 Isolation or not:非隔离 Output Channel:1 Insulated Voltage:- Conversion; LCSC Part Name: DC-DC 输入电压8V~36V 输出电压5V输出功率5W1000mA; Supplier Part: C2992391; Manufacturer: YLPTEC(易川); Supplier Footprint: 插件; JLCPCB Part Class: Extended Part; Datasheet: https://atta.szlcsc.com/upload/public/pdf/source/20220510/13042FEFCE8A01FC3BA968F60B4D6D28.pdf; Supplier: LCSC; Conversion Type: DC-DC; Input Voltage(DC): 8V~36V; Output Voltage: 5V; Output Power: 5W; Output Current (Max): 1A; Function: 升降压型; Isolation or not: 非隔离; Output Channel: 1; Conversion Efficiency: 93%; Feature: Short-Circuit Protection；Low-Power Consumption; Maximum Capacitive Load: 680uF
U3 = DS18B20+T&R: Supply Voltage:3V~5.5V Supply Voltage:3V~5.5V; Supplier Part: C880672; Manufacturer: ADI(亚德诺)/MAXIM(美信); Supplier Footprint: TO-92; JLCPCB Part Class: Extended Part; Datasheet: https://atta.szlcsc.com/upload/public/pdf/source/20201223/C880672_EEBB787AABBE3FE11FE7BE07B2E2EC5E.pdf; Supplier: LCSC; Supply Voltage: 3V~5.5V

## Nets
GND: C3.1 C4.2 C6.2 C7.2 C8.2 C9.2 D1.2(A) J1.3 J1.5 Q1.3(S) Q2.1(E) Q3.1(E) R2.2 R3.1 R4.2 U1.4(VO-) U2.2(GND) U3.1(GND)
EARTH: C1.1 C5.2 J3.1 J3.2 J3.3 J3.4
LIVE_IN: F1.1 K1.3
NEUTRAL: C2.2 J2.1 J2.2 J2.3 J2.4 L1.3 R1.2
NO_SIG: DS2.2(A) J1.1 R7.1
TEMP: J1.2 U3.2(DQ)
VRAW: C3.2 C4.1 C6.1 D1.1(C) D2.1(K) K1.1 R5.2 R6.2 U1.6(VO+) U2.1(VIN)
VSW: DS1.2(A) F2.2 J1.4 U3.3(VDD)
$1N597: C2.1 F1.2 L2.1 R1.1
$1N1225: C7.1 C8.1 C9.1 F2.1 U2.3(+VO)
$1N1636: D2.2(A) K1.2 Q1.2(D)
$1N1642: Q2.3(B) Q3.2(C) R5.1
$1N1643: Q3.3(B) R7.2
$1N1954: L1.4 L2.2
$1N1959: C5.1 L1.2 U1.2(ACL)
$1N1966: C1.2 L1.1 U1.1(ACN)
$1N3133: DS1.1(K) R2.1
$1N3135: DS2.1(K) R4.1
$1N3143: J1.6 R3.2
$1N3234: Q1.1(G) Q2.2(C) R6.1

Not connected (* = marked no-connect by the designer): J1 7* 8* 9* 10(MH1)* 11(MH2)*; K1 4*

## Notes on the sheet
- AC to 12V Power Module
- AC Power Connections
- Switch Connector and CBI LEDs
- Temperature Sensor
- AC Relay and Relay Driver
- 12v to 5v DC DC Regulator

# Board V2.0.1B PCB
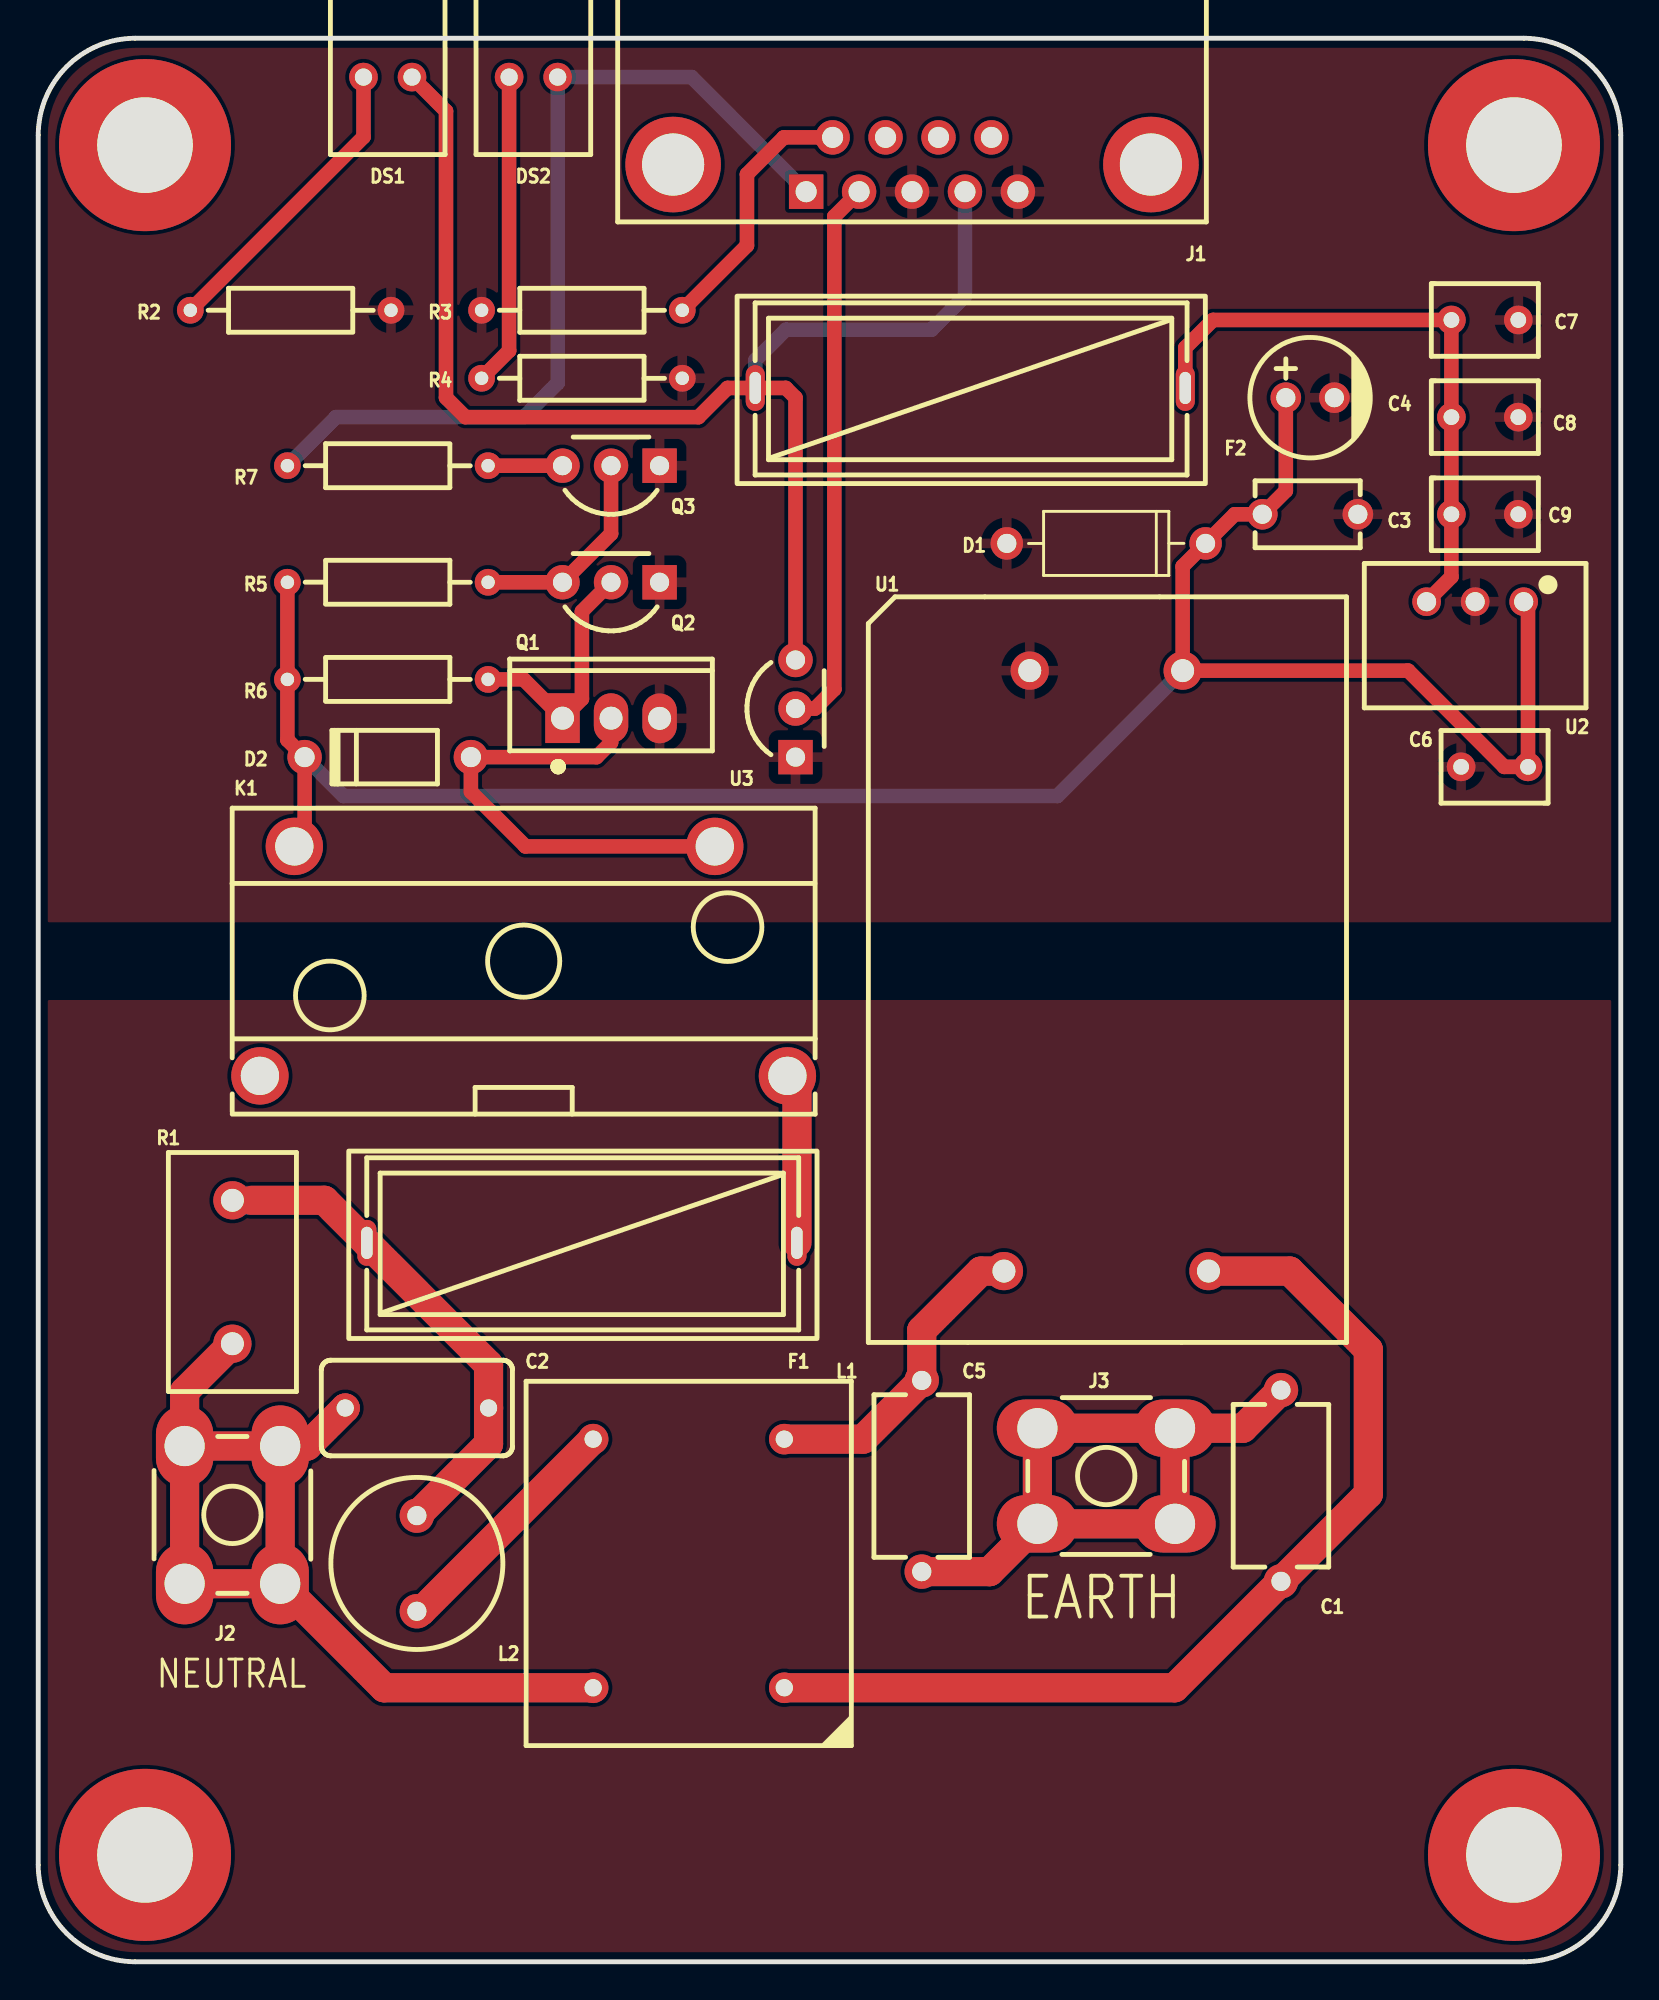
[diagram p2: board, top side]
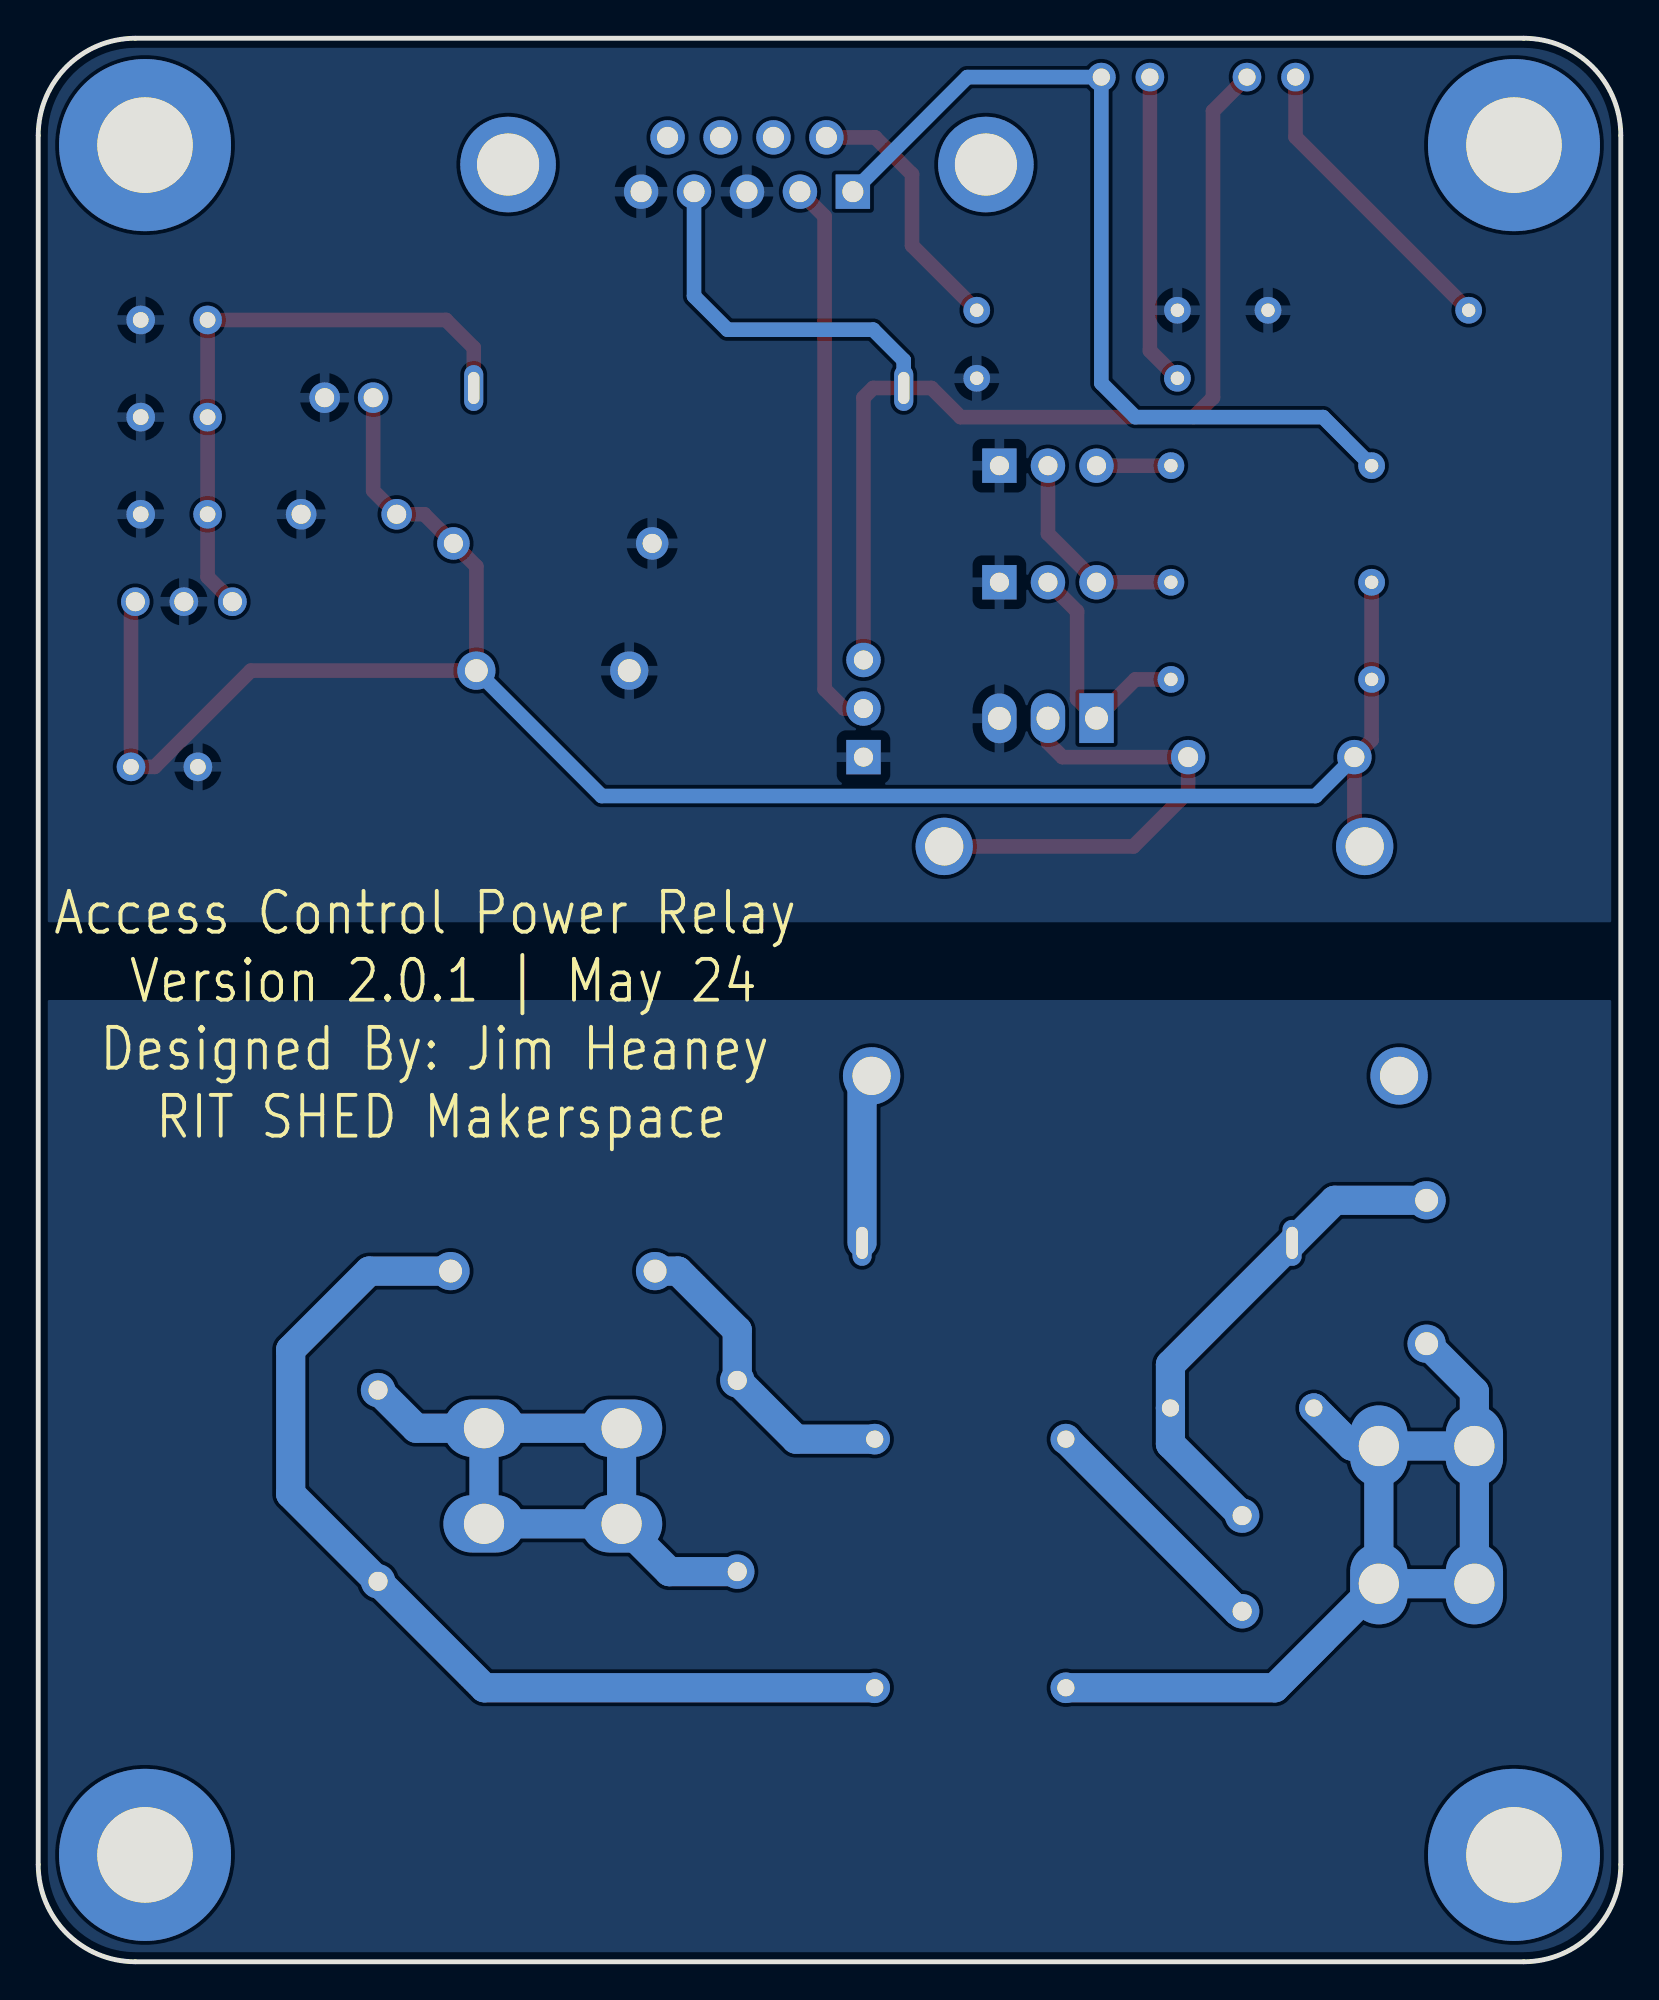
[diagram p3: board, bottom side, seen from below]

Outline 82.8 x 100.58 mm; copper layers: Top Layer, Bottom Layer. Coordinates in mm from the lower left corner of the outline.
Outline path: 0,95.5 0,5.08 arc(1.49,1.49) 5.08,0 77.72,0 arc(81.32,1.49) 82.8,5.08 82.8,95.5 arc(81.32,99.1) 77.72,100.58 5.08,100.58 arc(1.49,99.1) 0,95.5
Stack: Top Layer 0.035mm / Dielectric1 1.51mm FR4 er 4.5 / Bottom Layer 0.035mm

## Design rules (mm)
template: Custom Config
spacing copperThickness1oz (default): track to track 0.102, other pairs 0.152 to 0.3
spacing copperThickness2oz: track to track 0.203, other pairs 0.152 to 0.3
track width copperThickness1oz (default): min 0.127, default 0.254, max 2.54
track width copperThickness2oz: min 0.203, default 0.254, max 2.54
differential pair differentialPair (default): width min 0.127, default 0.254, max 2.54; gap min 0.152, default 0.152
via viaSize (default): diameter min 0.5, default 0.61, max 10; hole min 0.3, default 0.305, max 6.3
net STEAL uses stealcopper
pour e538 uses stealcopper

## Placement (name value [footprint] x y rotation side)
C1  1nF  [CAP-TH_L8.5-W5.0-P10.00-D0.6]  65.02 24.89 270 top
C2  100nF  [CAP-TH_L10.0-W5.0-P7.50-D0.6]  19.81 28.96 180 top
C3  1uF  [CAP-TH_L5.5-W3.5-P5.00-D1.2]  66.55 75.69 180 top
C4  220uF  [CAP-TH_BD6.3-P2.50-D1.0-FD]  66.55 81.79 0 top
C5  1nF  [CAP-TH_L8.5-W5.0-P10.00-D0.6]  46.23 25.4 270 top
C6  10uF  [CAP-TH_L5.5-W3.8-P3.50-D0.6]  76.2 62.48 180 top
C7  10uF  [CAP-TH_L5.5-W3.8-P3.50-D0.6]  75.69 85.85 0 top
C8  10uF  [CAP-TH_L5.5-W3.8-P3.50-D0.6]  75.69 80.77 0 top
C9  10uF  [CAP-TH_L5.5-W3.8-P3.50-D0.6]  75.69 75.69 0 top
D1  P6KE15A  [DO-15_BD3.2-L6.4-P10.40-D0.8-RD]  55.88 74.17 180 top
D2  1N4007  [DO-41_BD2.4-L4.7-P8.70-D0.8-RD]  18.29 62.99 0 top
DS1  MHK1560CRBTD  [LED-TH_MHK1560UGBTD]  18.29 98.55 180 top
DS2  MHK1560UGBTD  [LED-TH_MHK1560UGBTD]  25.91 98.55 180 top
F1  Fuse Holder  [FUSE-TH_L24.5-W9.8-P22.5]  28.45 37.59 180 top
F2  Fuse Holder  [FUSE-TH_L24.5-W9.8-P22.5]  48.77 82.3 180 top
J1  D-SUB-DR-9PCM-CB  [DB9-TH_ID09S33E4GV00LF]  45.72 93.98 180 top
J2  T34001  [CONN-TH_T34001]  10.16 23.37 0 top
J3  T34001  [CONN-TH_T34001]  55.88 25.4 90 top
K1  HF102F-12VDC  [RELAY-TH_HF102F-12VDC]  25.4 52.32 0 top
L1  YDUU10.5-253L0321  [IND-TH_4P-L19.0-W17.0]  34.04 20.83 90 top
L2  560uH  [IND-TH_BD9.0-P5.00-D0.7]  19.81 20.83 270 top
NOREF  -  [Pad_e183]  77.22 95 0 top
NOREF#2  -  [Pad_e181]  5.59 5.59 0 top
NOREF#3  -  [Pad_e182]  5.59 95 0 top
NOREF#4  -  [Pad_e184]  77.22 5.59 0 top
Q1  BRCS3205RA  [TO-220-3_L10.0-W4.5-P2.54-L]  29.97 65.02 0 top
Q2  2SC1815L-GR-T92-B  [TO-92-3_L4.9-W3.7-P2.54-L]  29.97 72.14 180 top
Q3  2SC1815L-GR-T92-B  [TO-92-3_L4.9-W3.7-P2.54-L]  29.97 78.23 180 top
R1  10D471K  [RES-TH_L12.5-W6.7-P7.50-D1.2]  10.16 36.07 270 top
R2  1kΩ  [RES-TH_BD2.3-L6.5-P10.50-D0.5]  13.21 86.36 0 top
R3  5.1kΩ  [RES-TH_BD2.3-L6.5-P10.50-D0.5]  28.45 86.36 0 top
R4  1kΩ  [RES-TH_BD2.3-L6.5-P10.50-D0.5]  28.45 82.8 0 top
R5  5.1kΩ  [RES-TH_BD2.3-L6.5-P10.50-D0.5]  18.29 72.14 180 top
R6  5.1kΩ  [RES-TH_BD2.3-L6.5-P10.50-D0.5]  18.29 67.06 180 top
R7  5.1kΩ  [RES-TH_BD2.3-L6.5-P10.50-D0.5]  18.29 78.23 0 top
U1  TAS10-12-W2  [PWRM-TH_TAS10-XX-W2]  55.88 51.82 90 top
U2  K7805-1000R3  [PWRM-TH_YLPTEC_K78XX-1000R3]  75.18 71.12 180 top
U3  DS18B20+T&R  [TO-92-3_L4.9-W3.7-P2.54-L]  39.62 65.53 90 top

## Footprints (pads in the part's own frame, mm; a bottom-side part is the same pattern mirrored in y, then rotated)
CAP-TH_BD6.3-P2.50-D1.0-FD
  round 1.6 hole 1: 1(-1.27,0) 2(1.27,0)
CAP-TH_L5.5-W3.5-P5.00-D1.2
  round 1.6 hole 1: 1(-2.5,0) 2(2.5,0)
CAP-TH_L5.5-W3.8-P3.50-D0.6
  round 1.5 hole 0.82: 1(-1.75,0) 2(1.75,0)
CAP-TH_L8.5-W5.0-P10.00-D0.6
  round 1.8 hole 1: 1(-5,0) 2(5,0)
CAP-TH_L10.0-W5.0-P7.50-D0.6
  round 1.524 hole 0.9: 1(-3.75,0) 2(3.75,0)
CONN-TH_T34001
  oval 3x4.25 hole 2.1: 1(-2.5,-3.6) 2(2.5,-3.6) 3(2.5,3.6) 4(-2.5,3.6)
DB9-TH_ID09S33E4GV00LF
  rect 1.8x1.8 hole 1.1: 1(5.54,1.42)
  round 1.8 hole 1.1: 2(2.77,1.42) 3(0,1.42) 4(-2.77,1.42) 5(-5.54,1.42) 6(4.155,-1.42) 7(1.385,-1.42) 8(-1.385,-1.42) 9(-4.155,-1.42)
  round 5 hole 3.25: 10(-12.5,0) 11(12.5,0)
DO-15_BD3.2-L6.4-P10.40-D0.8-RD
  round 1.7 hole 1: 1(-5.2,0) 2(5.2,0)
DO-41_BD2.4-L4.7-P8.70-D0.8-RD
  round 1.8 hole 1.05: 1(-4.35,0) 2(4.35,0)
FUSE-TH_L24.5-W9.8-P22.5
  oval 1x2.4 hole 0.6x1.68: 1(-11.25,0) 2(11.25,0)
IND-TH_4P-L19.0-W17.0
  round 1.6 hole 0.9: 1(-6.5,-5) 2(6.5,-5) 3(-6.5,5) 4(6.5,5)
IND-TH_BD9.0-P5.00-D0.7
  round 1.8 hole 1: 1(-2.5,0) 2(2.5,0)
LED-TH_MHK1560UGBTD
  round 1.5 hole 0.9: 1(1.27,0) 2(-1.27,0)
Pad_e181
  round 9 hole 5: 5(0,0)
Pad_e182
  round 9 hole 5: 5(0,0)
Pad_e183
  round 9 hole 5: 5(0,0)
Pad_e184
  round 9 hole 5: 5(0,0)
PWRM-TH_TAS10-XX-W2
  round 2 hole 1.2: 1(-15.7,-5.35) 2(-15.7,5.35) 4(15.7,4) 6(15.7,-4)
PWRM-TH_YLPTEC_K78XX-1000R3
  round 1.5 hole 1: 1(-2.54,0) 2(0,0) 3(2.54,0)
RELAY-TH_HF102F-12VDC
  round 3 hole 2: 1(-12,6) 2(10,6) 3(13.8,-6) 4(-13.8,-6)
RES-TH_BD2.3-L6.5-P10.50-D0.5
  round 1.4 hole 0.7: 1(-5.25,0) 2(5.25,0)
RES-TH_L12.5-W6.7-P7.50-D1.2
  round 2 hole 1.2: 1(-3.749,0) 2(3.749,0)
TO-92-3_L4.9-W3.7-P2.54-L
  rect 1.8x1.8 hole 1: 1(-2.54,0)
  round 1.8 hole 1: 2(0,0) 3(2.54,0)
TO-220-3_L10.0-W4.5-P2.54-L
  rect 1.8x2.6 hole 1.2: 1(-2.54,0.005)
  oval 1.8x2.6 hole 1.2: 2(0,0.005) 3(2.54,-0.005)

## Nets
As in the schematic.

Pads without a net: J1 7 8 9 10 11; K1 4; NOREF 5; NOREF#2 5; NOREF#3 5; NOREF#4 5

## Routing (per net, layer and track width the routed paths; a pad name or vN(x,y) marks a point on that pad's centre or on a via; arc(x,y) is an arc through that point)
EARTH: length 75.7
  Top Layer w1.524: C5.2 49.78,20.4 J3.4 ; J3.2 63.03,27.9 C1.1 ; J3.2 J3.3 J3.4 ; J3.2 J3.1 J3.4
  Bottom Layer w1.524: J3.4 J3.3 J3.2 ; J3.4 J3.1 J3.2 ; J3.4 49.78,20.4 C5.2 ; J3.2 63.03,27.9 C1.1
LIVE_IN: length 17.9
  Top Layer w1.524: K1.3 39.7,45.83 F1.1
  Bottom Layer w1.524: K1.3 39.7,45.83 F1.1
NEUTRAL: length 107.3
  Top Layer w1.524: J2.2 J2.1 J2.4 ; J2.2 J2.3 ; J2.2 18.1,14.33 L1.3 ; J2.3 14.07,26.97 C2.2 ; J2.3 J2.4 ; J2.4 7.66,29.82 R1.2
  Bottom Layer w1.524: J2.4 J2.1 J2.2 ; J2.4 J2.3 ; J2.4 7.66,29.82 R1.2 ; J2.2 J2.3 ; J2.2 18.1,14.33 L1.3 ; J2.3 14.07,26.97 C2.2
NO_SIG: length 47.4
  Bottom Layer w0.762: R7.1 15.58,80.77 25.4,80.77 27.18,82.55 DS2.2 34.19,98.55 J1.1
TEMP: length 29
  Top Layer w0.762: U3.2 40.64,65.53 41.66,66.55 41.66,91.27 J1.2
VRAW: length 110.1
  Top Layer w0.762: C4.1 65.28,76.92 C3.2 62.6,75.69 D1.1 59.88,72.97 U1.6 71.68,67.52 76.71,62.48 C6.1 77.95,70.89 U2.1 ; R5.2 R6.2 13.04,63.89 D2.1 13.94,58.86 K1.1
  Bottom Layer w0.762: U1.6 53.32,60.96 15.97,60.96 D2.1
VSW: length 70
  Top Layer w0.762: U3.3 39.62,81.79 39.12,82.3 F2.2 36.07,82.3 34.54,80.77 22.35,80.77 21.34,81.79 21.34,96.77 DS1.2
  Bottom Layer w0.762: J1.4 48.49,87.1 46.74,85.34 39.12,85.34 37.52,83.75 F2.2
$1N597: length 51.8
  Top Layer w1.524: L2.1 23.56,27.08 C2.1 23.56,31.23 F1.2 14.97,39.82 11.18,39.82
  Bottom Layer w1.524: L2.1 23.56,27.08 C2.1 23.56,31.23 F1.2 14.97,39.82 R1.1
$1N1225: length 31.9
  Top Layer w0.762: F2.1 60.02,84.4 61.47,85.85 C7.1 C8.1 C9.1 73.94,72.42 U2.3
$1N1636: length 24.7
  Top Layer w0.762: K1.2 25.5,58.32 22.64,61.18 D2.2 29.21,62.99 29.97,63.75 29.97,65.02
$1N1642: length 11
  Top Layer w0.762: Q3.2 29.97,74.68 Q2.3 R5.1
$1N1643: length 3.9
  Top Layer w0.762: Q3.3 R7.2
$1N1954: length 25.9
  Top Layer w1.524: L2.2 20.04,18.33 L1.4
  Bottom Layer w1.524: L2.2 20.04,18.33 L1.4
$1N1959: length 33.3
  Top Layer w1.524: U1.2 49.32,36.12 46.23,33.02 C5.1 43.16,27.33 L1.2
  Bottom Layer w1.524: L1.2 43.16,27.33 C5.1 46.23,33.02 49.32,36.12 U1.2
$1N1966: length 104.7
  Top Layer w1.524: U1.1 65.48,36.12 69.6,32 69.6,24.46 C1.2 59.46,14.33 L1.1
  Bottom Layer w1.524: L1.1 59.46,14.33 C1.2 69.6,24.46 69.6,32 65.48,36.12 U1.1
$1N3133: length 15.9
  Top Layer w0.762: DS1.1 17.02,95.42 R2.1
$1N3135: length 16.3
  Top Layer w0.762: DS2.1 24.64,84.24 R4.1
$1N3143: length 13.8
  Top Layer w0.762: R3.2 37.08,89.75 37.08,93.47 39.01,95.4 J1.6
$1N3234: length 12.9
  Top Layer w0.762: R6.1 25.4,67.06 27.43,65.02 28.45,66.04 28.45,70.61 Q2.2

## Copper pours and planes (outline as drawn; the poured copper is in the pictures)
GND on Top Layer: -14.22,103.12 88.39,103.12 88.39,54.36 -14.22,54.36
GND on Bottom Layer: -3.05,107.19 93.47,107.19 93.47,54.36 -3.05,54.36
STEAL on Top Layer: -3.05,50.29 103.63,50.29 103.63,0 -3.05,0
STEAL on Bottom Layer: -3.05,50.29 93.47,50.29 93.47,-3.05 -3.05,-3.05

## Text on the board
Bottom Silkscreen Layer: RIT SHED Makerspace | Version 2.0.1 | May 24 | Designed By: Jim Heaney | Access Control Power Relay
Top Silkscreen Layer: NEUTRAL | EARTH

# Board V2.0.1 Power Relay PCB
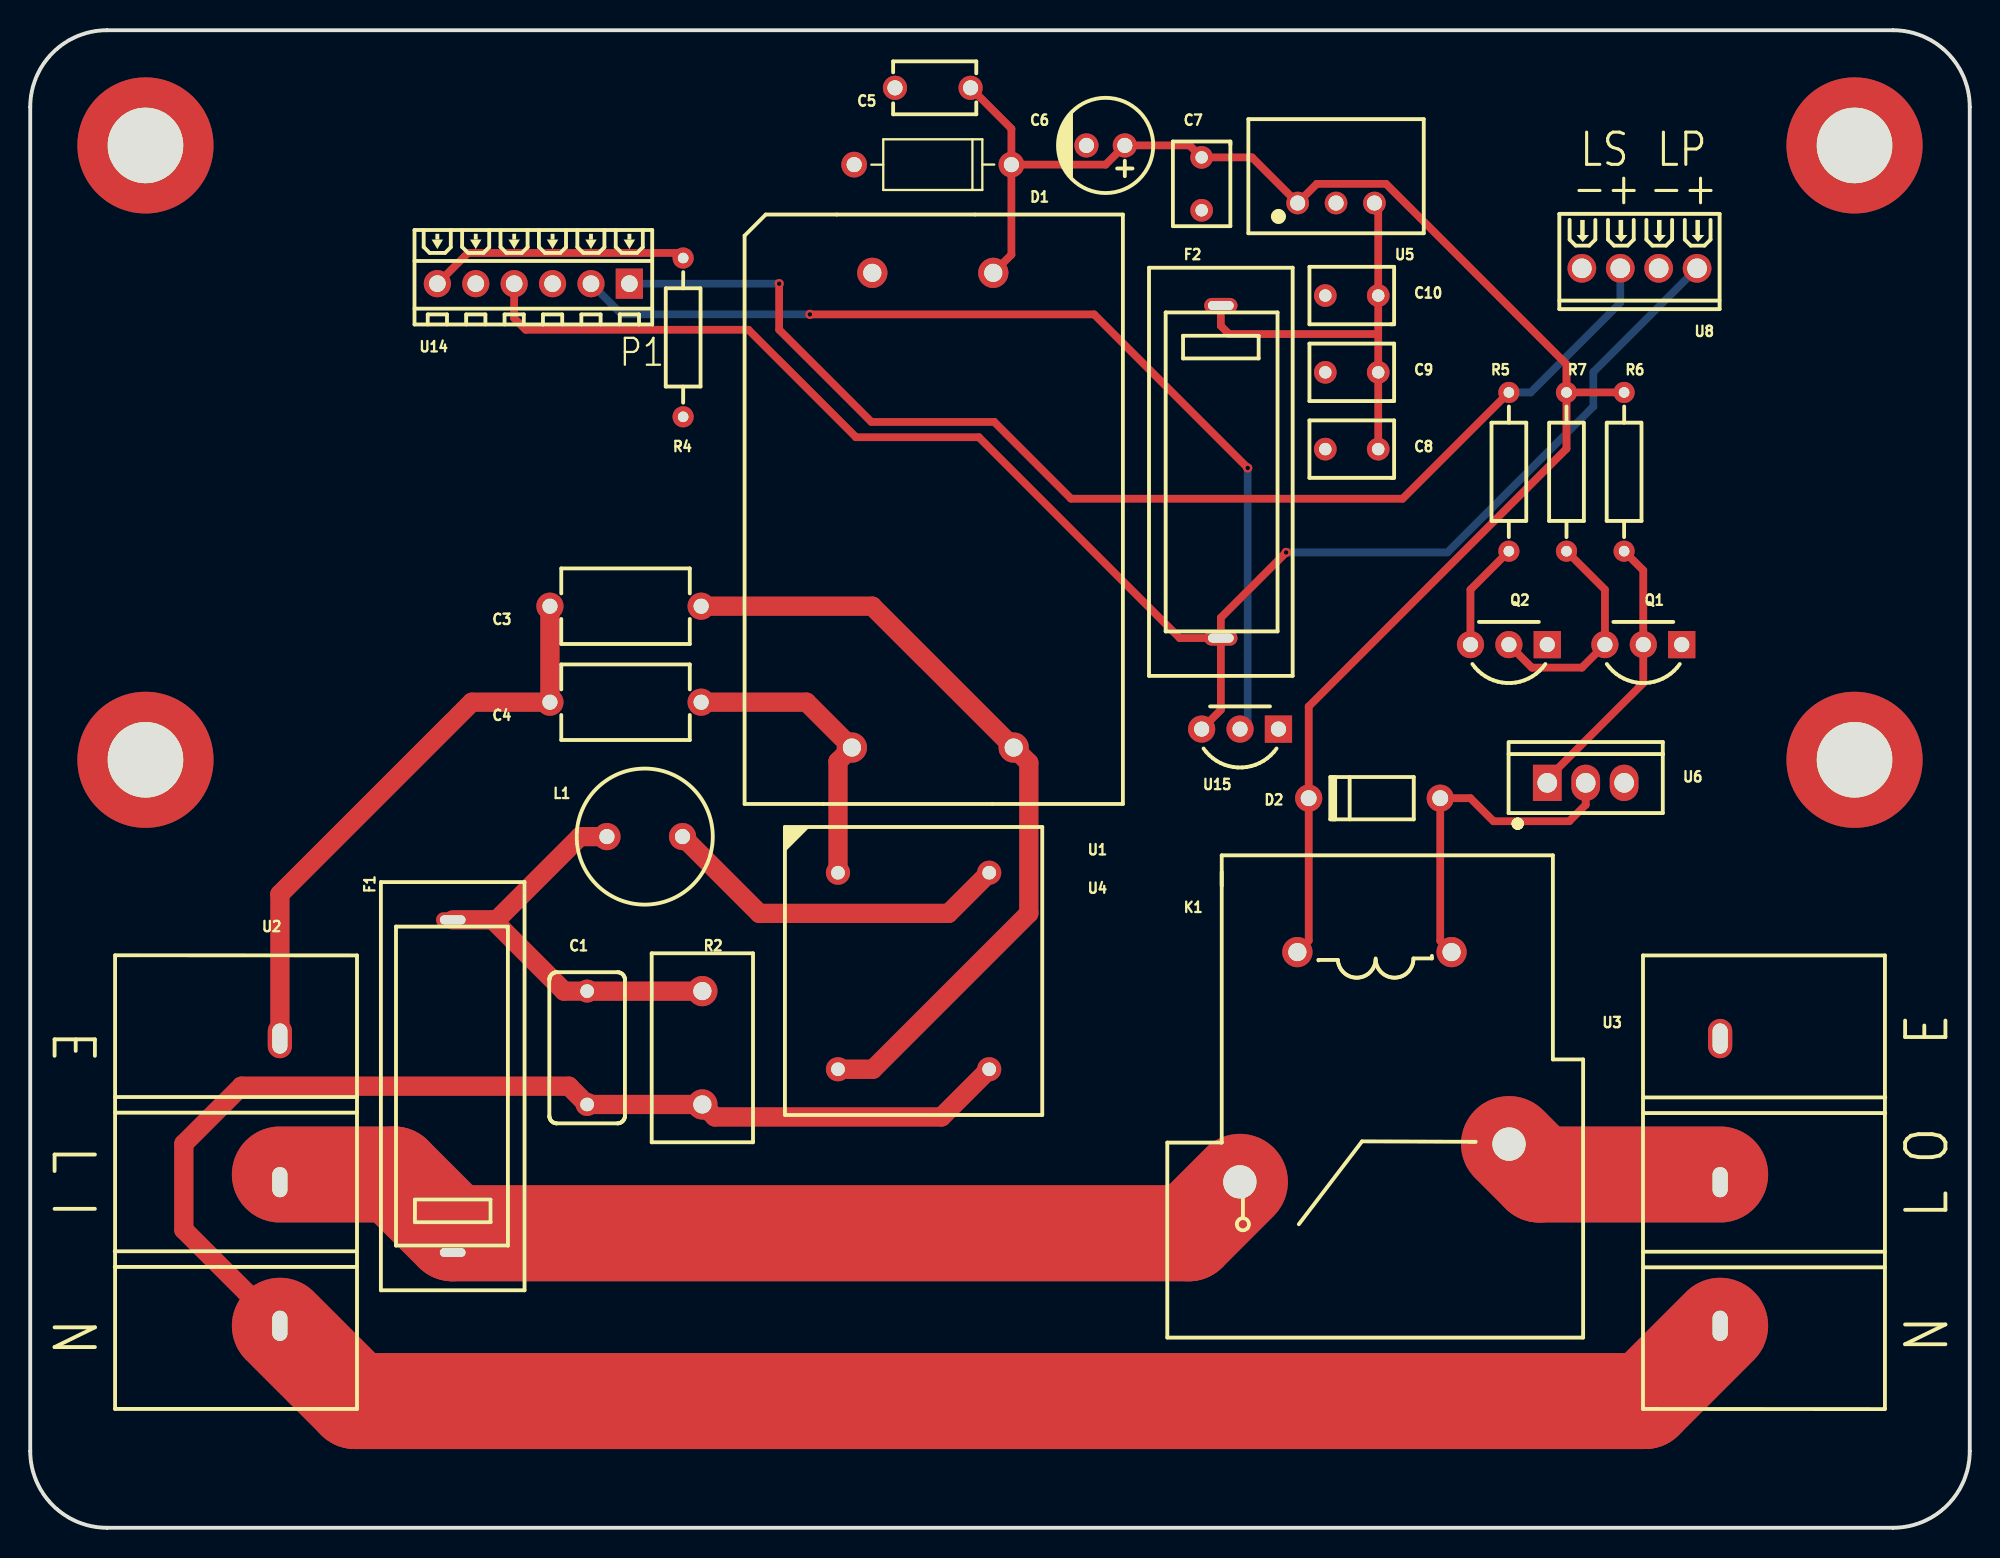
[diagram p4: board, top side]
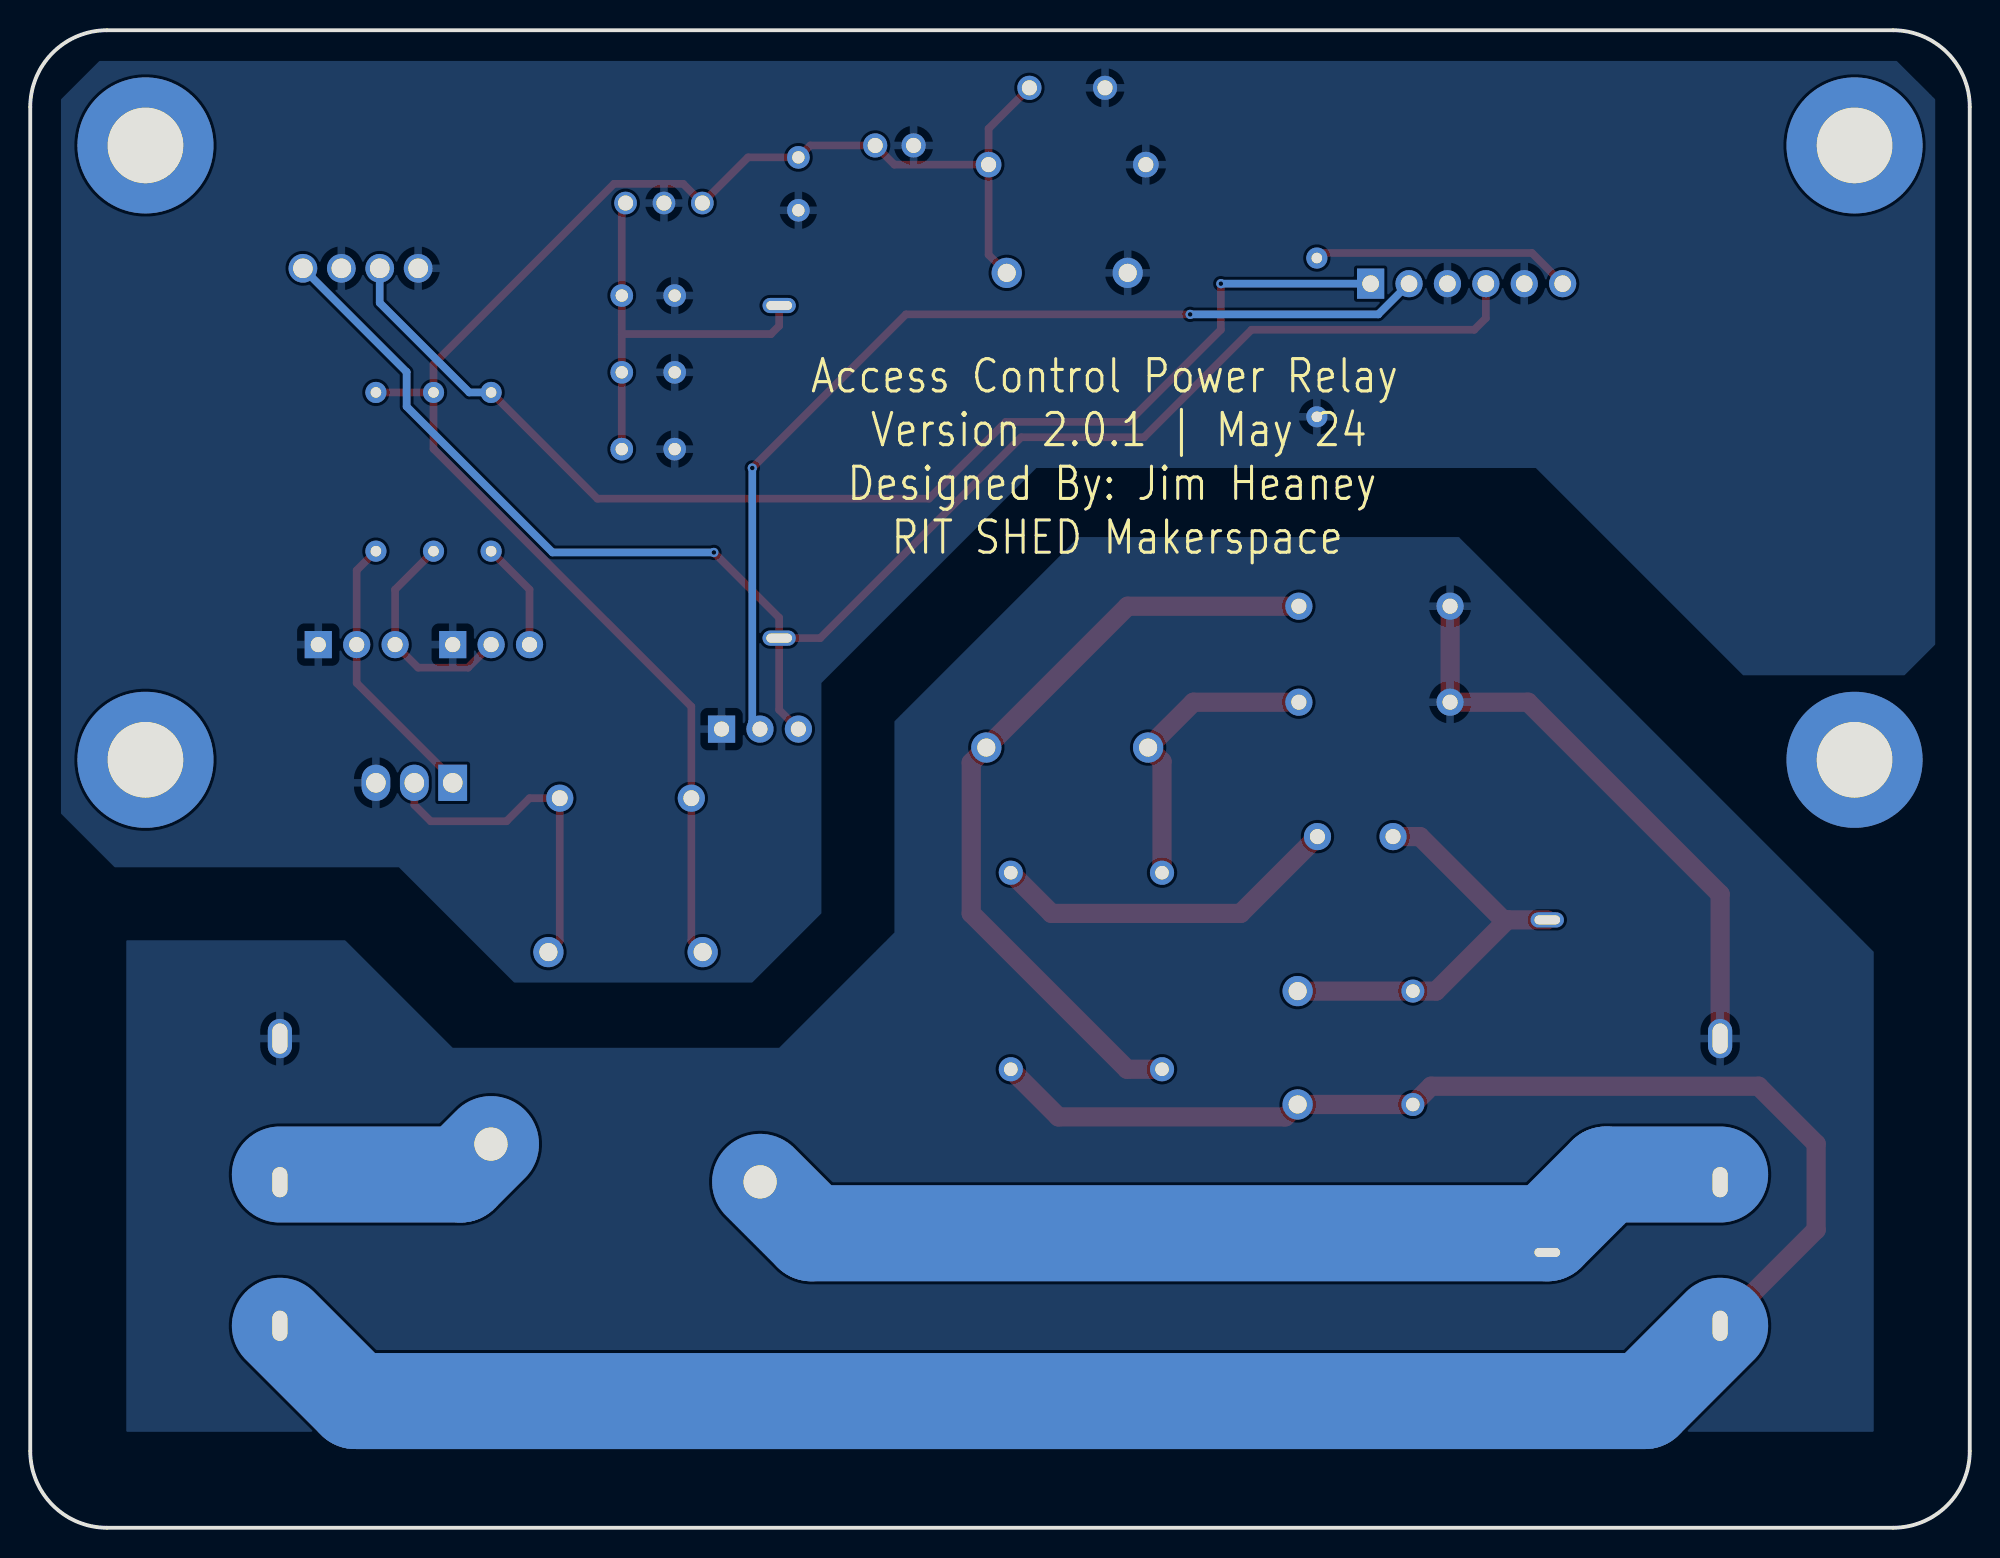
[diagram p5: board, bottom side, seen from below]

Outline 128.27 x 99.06 mm; copper layers: Top Layer, Bottom Layer. Coordinates in mm from the lower left corner of the outline.
Outline path: 0,93.98 0,5.08 arc(1.49,1.49) 5.08,0 123.19,0 arc(126.78,1.49) 128.27,5.08 128.27,93.98 arc(126.78,97.57) 123.19,99.06 5.08,99.06 arc(1.49,97.57) 0,93.98
Stack: Top Layer 0.035mm / Dielectric1 1.51mm FR4 er 4.5 / Bottom Layer 0.035mm

## Design rules (mm)
template: Custom Config
spacing copperThickness1oz (default): track to track 0.102, other pairs 0.152 to 0.3
spacing copperThickness2oz: track to track 0.203, other pairs 0.152 to 0.3
track width copperThickness1oz (default): min 0.127, default 0.254, max 50.8
track width copperThickness2oz: min 0.203, default 0.254, max 2.54
differential pair differentialPair (default): width min 0.127, default 0.254, max 2.54; gap min 0.152, default 0.152
via viaSize (default): diameter min 0.5, default 0.61, max 10; hole min 0.3, default 0.305, max 6.299
pour e695 uses copperRegion1

## Placement (name value [footprint] x y rotation side)
C1  100nF  [CAP-TH_L10.0-W5.0-P7.50-D0.6]  36.83 31.75 270 top
C3  1nF  [CAP-TH_L8.5-W5.0-P10.00-D0.6]  39.37 60.96 0 top
C4  1nF  [CAP-TH_L8.5-W5.0-P10.00-D0.6]  39.37 54.61 180 top
C5  1uF  [CAP-TH_L5.5-W3.5-P5.00-D1.2]  59.69 95.25 0 top
C6  220uF  [CAP-TH_BD6.3-P2.50-D1.0-FD]  71.12 91.44 180 top
C7  10uF  [CAP-TH_L5.5-W3.8-P3.50-D0.6]  77.47 88.9 270 top
C8  10uF  [CAP-TH_L5.5-W3.8-P3.50-D0.6]  87.4 71.35 180 top
C9  10uF  [CAP-TH_L5.5-W3.8-P3.50-D0.6]  87.4 76.43 180 top
C10  10uF  [CAP-TH_L5.5-W3.8-P3.50-D0.6]  87.4 81.51 180 top
D1  P6KE15A  [DO-15_BD3.2-L6.4-P10.40-D0.8-RD]  59.69 90.17 180 top
D2  1N4007  [DO-41_BD2.4-L4.7-P8.70-D0.8-RD]  88.9 48.26 0 top
F1  5x20 BLX-A型 保险丝支架 XC-7  [FUSE-TH_L22.6-W9.0]  27.94 29.21 90 top
F2  5x20 BLX-A型 保险丝支架 XC-7  [FUSE-TH_L22.6-W9.0]  78.74 69.85 270 top
K1  NB90E-12S-S-A  [RELAY-TH_NB90E-XXS-S-A]  88.9 30.48 180 top
L1  560uH  [IND-TH_BD9.0-P5.00-D0.7]  40.64 45.72 0 top
NOREF  -  [Pad_e847]  7.62 50.8 0 top
NOREF#2  -  [Pad_e844]  7.62 91.44 0 top
NOREF#3  -  [Pad_e848]  120.65 50.8 0 top
NOREF#4  -  [Pad_e846]  120.65 91.44 0 top
Q1  2SC1815L-GR-T92-B  [TO-92-3_L4.9-W3.7-P2.54-L]  106.68 58.42 180 top
Q2  2SC1815L-GR-T92-B  [TO-92-3_L4.9-W3.7-P2.54-L]  97.79 58.42 180 top
R2  10D471K  [RES-TH_L12.5-W6.7-P7.50-D1.2]  44.45 31.75 270 top
R4  5.1kΩ  [RES-TH_BD2.3-L6.5-P10.50-D0.5]  43.18 78.74 90 top
R5  5.1kΩ  [RES-TH_BD2.3-L6.5-P10.50-D0.5]  97.79 69.85 270 top
R6  5.1kΩ  [RES-TH_BD2.3-L6.5-P10.50-D0.5]  105.41 69.85 90 top
R7  5.1kΩ  [RES-TH_BD2.3-L6.5-P10.50-D0.5]  101.6 69.85 90 top
U1  TAS10-12-W2  [PWRM-TH_TAS10-XX-W2]  59.69 67.31 90 top
U2  DBT50G-9.5-3P  [CONN-TH_3P-P9.50_DBT50G-9.5-3P]  16.51 22.86 270 top
U3  DBT50G-9.5-3P  [CONN-TH_3P-P9.50_DBT50G-9.5-3P]  111.76 22.86 90 top
U4  YDUU10.5-253L0321  [IND-TH_4P-L19.0-W17.0]  58.42 36.83 270 top
U5  K7805-1000R3  [PWRM-TH_YLPTEC_K78XX-1000R3]  86.36 87.63 0 top
U6  WGP30N10V  [TO-220-3_L10.0-W4.6-P2.54-L]  102.87 49.28 0 top
U8  MX128-2.54-04P-GN01-Cu-Y-A  [CONN-TH_4P-P2.54_MX128-2.54-GN01-04P-CU-Y-A]  106.43 83.31 180 top
U14  MX128-2.54-06P-GN01-Cu-Y-A  [CONN-TH_6P-P2.54_MX128-2.54-6P]  33.27 82.3 180 top
U15  DS18B20+T&R  [TO-92-3_L4.9-W3.7-P2.54-L]  80.01 52.83 180 top

## Footprints (pads in the part's own frame, mm; a bottom-side part is the same pattern mirrored in y, then rotated)
CAP-TH_BD6.3-P2.50-D1.0-FD
  round 1.6 hole 1: 1(-1.27,0) 2(1.27,0)
CAP-TH_L5.5-W3.5-P5.00-D1.2
  round 1.6 hole 1: 1(-2.5,0) 2(2.5,0)
CAP-TH_L5.5-W3.8-P3.50-D0.6
  round 1.5 hole 0.82: 1(-1.75,0) 2(1.75,0)
CAP-TH_L8.5-W5.0-P10.00-D0.6
  round 1.8 hole 1: 1(-5,0) 2(5,0)
CAP-TH_L10.0-W5.0-P7.50-D0.6
  round 1.524 hole 0.9: 1(-3.75,0) 2(3.75,0)
CONN-TH_3P-P9.50_DBT50G-9.5-3P
  oval 2.6x1.6 hole 2x1: 1(-9.5,0) 2(0,0) 3(9.5,0)
CONN-TH_4P-P2.54_MX128-2.54-GN01-04P-CU-Y-A
  round 1.9 hole 1.3: 1(-3.81,0) 2(-1.27,0) 3(1.27,0) 4(3.81,0)
CONN-TH_6P-P2.54_MX128-2.54-6P
  rect 1.8x2 hole 1.1: 1(-6.35,0)
  round 1.8 hole 1.1: 2(-3.81,0) 3(-1.27,0) 4(1.27,0) 5(3.81,0) 6(6.35,0)
DO-15_BD3.2-L6.4-P10.40-D0.8-RD
  round 1.7 hole 1: 1(-5.2,0) 2(5.2,0)
DO-41_BD2.4-L4.7-P8.70-D0.8-RD
  round 1.8 hole 1.05: 1(-4.35,0) 2(4.35,0)
FUSE-TH_L22.6-W9.0
  oval 1x2.2 hole 0.6x1.7: 1(-11,0) 2(11,0)
IND-TH_4P-L19.0-W17.0
  round 1.6 hole 0.9: 1(-6.5,-5) 2(6.5,-5) 3(-6.5,5) 4(6.5,5)
IND-TH_BD9.0-P5.00-D0.7
  round 1.8 hole 1: 1(-2.5,0) 2(2.5,0)
Pad_e844
  round 9 hole 5: 5(0,0)
Pad_e846
  round 9 hole 5: 5(0,0)
Pad_e847
  round 9 hole 5: 5(0,0)
Pad_e848
  round 9 hole 5: 5(0,0)
PWRM-TH_TAS10-XX-W2
  round 2 hole 1.2: 1(-15.7,-5.35) 2(-15.7,5.35) 4(15.7,4) 6(15.7,-4)
PWRM-TH_YLPTEC_K78XX-1000R3
  round 1.5 hole 1: 1(-2.54,0) 2(0,0) 3(2.54,0)
RELAY-TH_NB90E-XXS-S-A
  round 3 hole 2.2: 1(-8.9,5.101) 4(8.9,7.599)
  round 2 hole 1.2: 2(-5.1,-7.599) 3(5.1,-7.599)
RES-TH_BD2.3-L6.5-P10.50-D0.5
  round 1.4 hole 0.7: 1(-5.25,0) 2(5.25,0)
RES-TH_L12.5-W6.7-P7.50-D1.2
  round 2 hole 1.2: 1(-3.749,0) 2(3.749,0)
TO-92-3_L4.9-W3.7-P2.54-L
  rect 1.8x1.8 hole 1: 1(-2.54,0)
  round 1.8 hole 1: 2(0,0) 3(2.54,0)
TO-220-3_L10.0-W4.6-P2.54-L
  rect 1.9x2.4 hole 1.3: 1(-2.54,0)
  oval 1.9x2.4 hole 1.3: 2(0,0) 3(2.54,0)

## Nets
As in the schematic.

Pads without a net: NOREF 5; NOREF#2 5; NOREF#3 5; NOREF#4 5

## Via types
v1: diameter 0.61, hole 0.305, Top Layer to Bottom Layer, 4 vias

## Routing (per net, layer and track width the routed paths; a pad name or vN(x,y) marks a point on that pad's centre or on a via; arc(x,y) is an arc through that point)
EARTH: length 39
  Top Layer w1.27: U2.1 16.51,41.91 29.21,54.61 C4.2 C3.1
LIVE_IN: length 133
  Top Layer w6.35: K1.4 76.6,19.48 27.94,19.48 24.05,23.37 16.51,23.37
  Bottom Layer w6.35: 16.51,23.37 24.05,23.37 27.94,19.48 76.6,19.48 K1.4
LIVE_OUT: length 29.6
  Top Layer w6.35: K1.1 99.81,23.37 111.76,23.37
  Bottom Layer w6.35: 111.76,23.37 99.81,23.37 K1.1
NEUTRAL: length 270.4
  Top Layer w1.27: U4.4 60.27,27.18 45.27,27.18 R2.2 C1.2 35.62,29.21 13.97,29.21 10.16,25.4 10.16,19.71 U2.3
  Top Layer w6.35: U2.3 21.49,8.38 106.78,8.38 U3.1
  Bottom Layer w6.35: U2.3 21.49,8.38 106.78,8.38 U3.1
NO_SIG: length 80.9
  Top Layer w0.508: R5.1 90.76,68.07 68.83,68.07 63.75,73.15 55.63,73.15 49.53,79.25 v1(49.53,82.3)
  Bottom Layer w0.508: v1(49.53,82.3) U14.1 ; U8.3 105.16,81.03 99.23,75.1 R5.1
TEMP: length 66
  Top Layer w0.508: v1(80.52,70.1) 70.36,80.26 v1(51.56,80.26)
  Bottom Layer w0.508: v1(80.52,70.1) 80.52,53.34 U15.2 ; U14.2 39.12,80.26 v1(51.56,80.26)
VRAW: length 108.2
  Top Layer w0.508: U1.6 64.89,84.21 D1.1 ; C5.2 64.89,92.55 D1.1 ; R7.2 R6.2 ; R7.2 101.6,76.96 89.66,88.9 85.09,88.9 U5.1 80.8,90.65 C7.1 76.68,91.44 C6.1 71.12,90.17 D1.1 ; R7.2 101.6,71.37 84.55,54.32 D2.1 84.55,38.83 K1.3
VSW: length 108.1
  Top Layer w0.508: U15.3 78.74,54.1 F2.2 ; F2.2 76.02,58.85 62.74,72.14 54.61,72.14 47.5,79.25 32.77,79.25 32,80.01 U14.4 ; F2.2 78.74,60.2 v1(83.06,64.52)
  Bottom Layer w0.508: U8.1 103.38,76.45 103.38,74.17 93.73,64.52 v1(83.06,64.52)
$1N1267: length 28.3
  Top Layer w1.27: 30.59,40.21 30.85,40.21 36.36,45.72 L1.1 ; 30.59,40.21 35.3,35.5 C1.1 R2.1 ; 30.59,40.21 F1.2
$1N2210: length 28.4
  Top Layer w0.508: F2.1 78.74,79.5 79.28,78.96 89.15,78.96 ; C8.1 C9.1 89.15,78.96 ; 89.15,78.96 C10.1 89.15,87.38 U5.3
$1N2775: length 22.6
  Top Layer w0.508: U6.2 102.87,47.82 101.78,46.74 96.77,46.74 95.25,48.26 D2.2 93.25,38.83 K1.2
$1N2784: length 18.5
  Top Layer w0.508: U6.1 100.33,49.53 106.68,55.88 Q1.2 106.68,63.33 R6.1
$1N3014: length 14.8
  Top Layer w0.508: Q2.2 99.31,56.9 102.62,56.9 Q1.3 104.14,62.06 R7.1
$1N3022: length 7.2
  Top Layer w0.508: Q2.3 95.25,62.06 R5.2
$1N3091: length 23.5
  Top Layer w1.27: U4.3 60.73,40.64 48.22,40.64 L1.2
$1N3100: length 52.8
  Top Layer w1.27: U4.2 55.73,30.33 66.04,40.64 66.04,50.61 U1.1 55.69,60.96 C3.2
$1N3107: length 19.9
  Top Layer w1.27: U4.1 53.42,50.69 U1.2 51.34,54.61 C4.1
$1N5095: length 17.2
  Top Layer w0.508: R4.2 42.84,84.33 28.96,84.33 U14.6

## Copper pours and planes (outline as drawn; the poured copper is in the pictures)
GND on Bottom Layer: 61.72,70.1 75.95,55.88 75.95,40.64 80.52,36.07 96.27,36.07 103.89,43.69 122.68,43.69 126.24,47.24 126.24,94.49 123.7,97.03 4.83,97.03 2.29,94.49 2.29,58.42 4.32,56.39 14.99,56.39 28.7,70.1
EARTH on Bottom Layer: 6.35,6.35 121.92,6.35 121.92,38.86 107.44,38.86 100.33,31.75 78.74,31.75 71.12,39.37 71.12,53.34 58.93,65.53 33.78,65.53 6.35,38.1

## Text on the board
Bottom Silkscreen Layer: RIT SHED Makerspace | Version 2.0.1 | May 24 | Designed By: Jim Heaney | Access Control Power Relay
Top Silkscreen Layer: P1 | -+ | LS | LP | E | L I | N | L O
